# Altium project Keypadmacro.PrjPcb
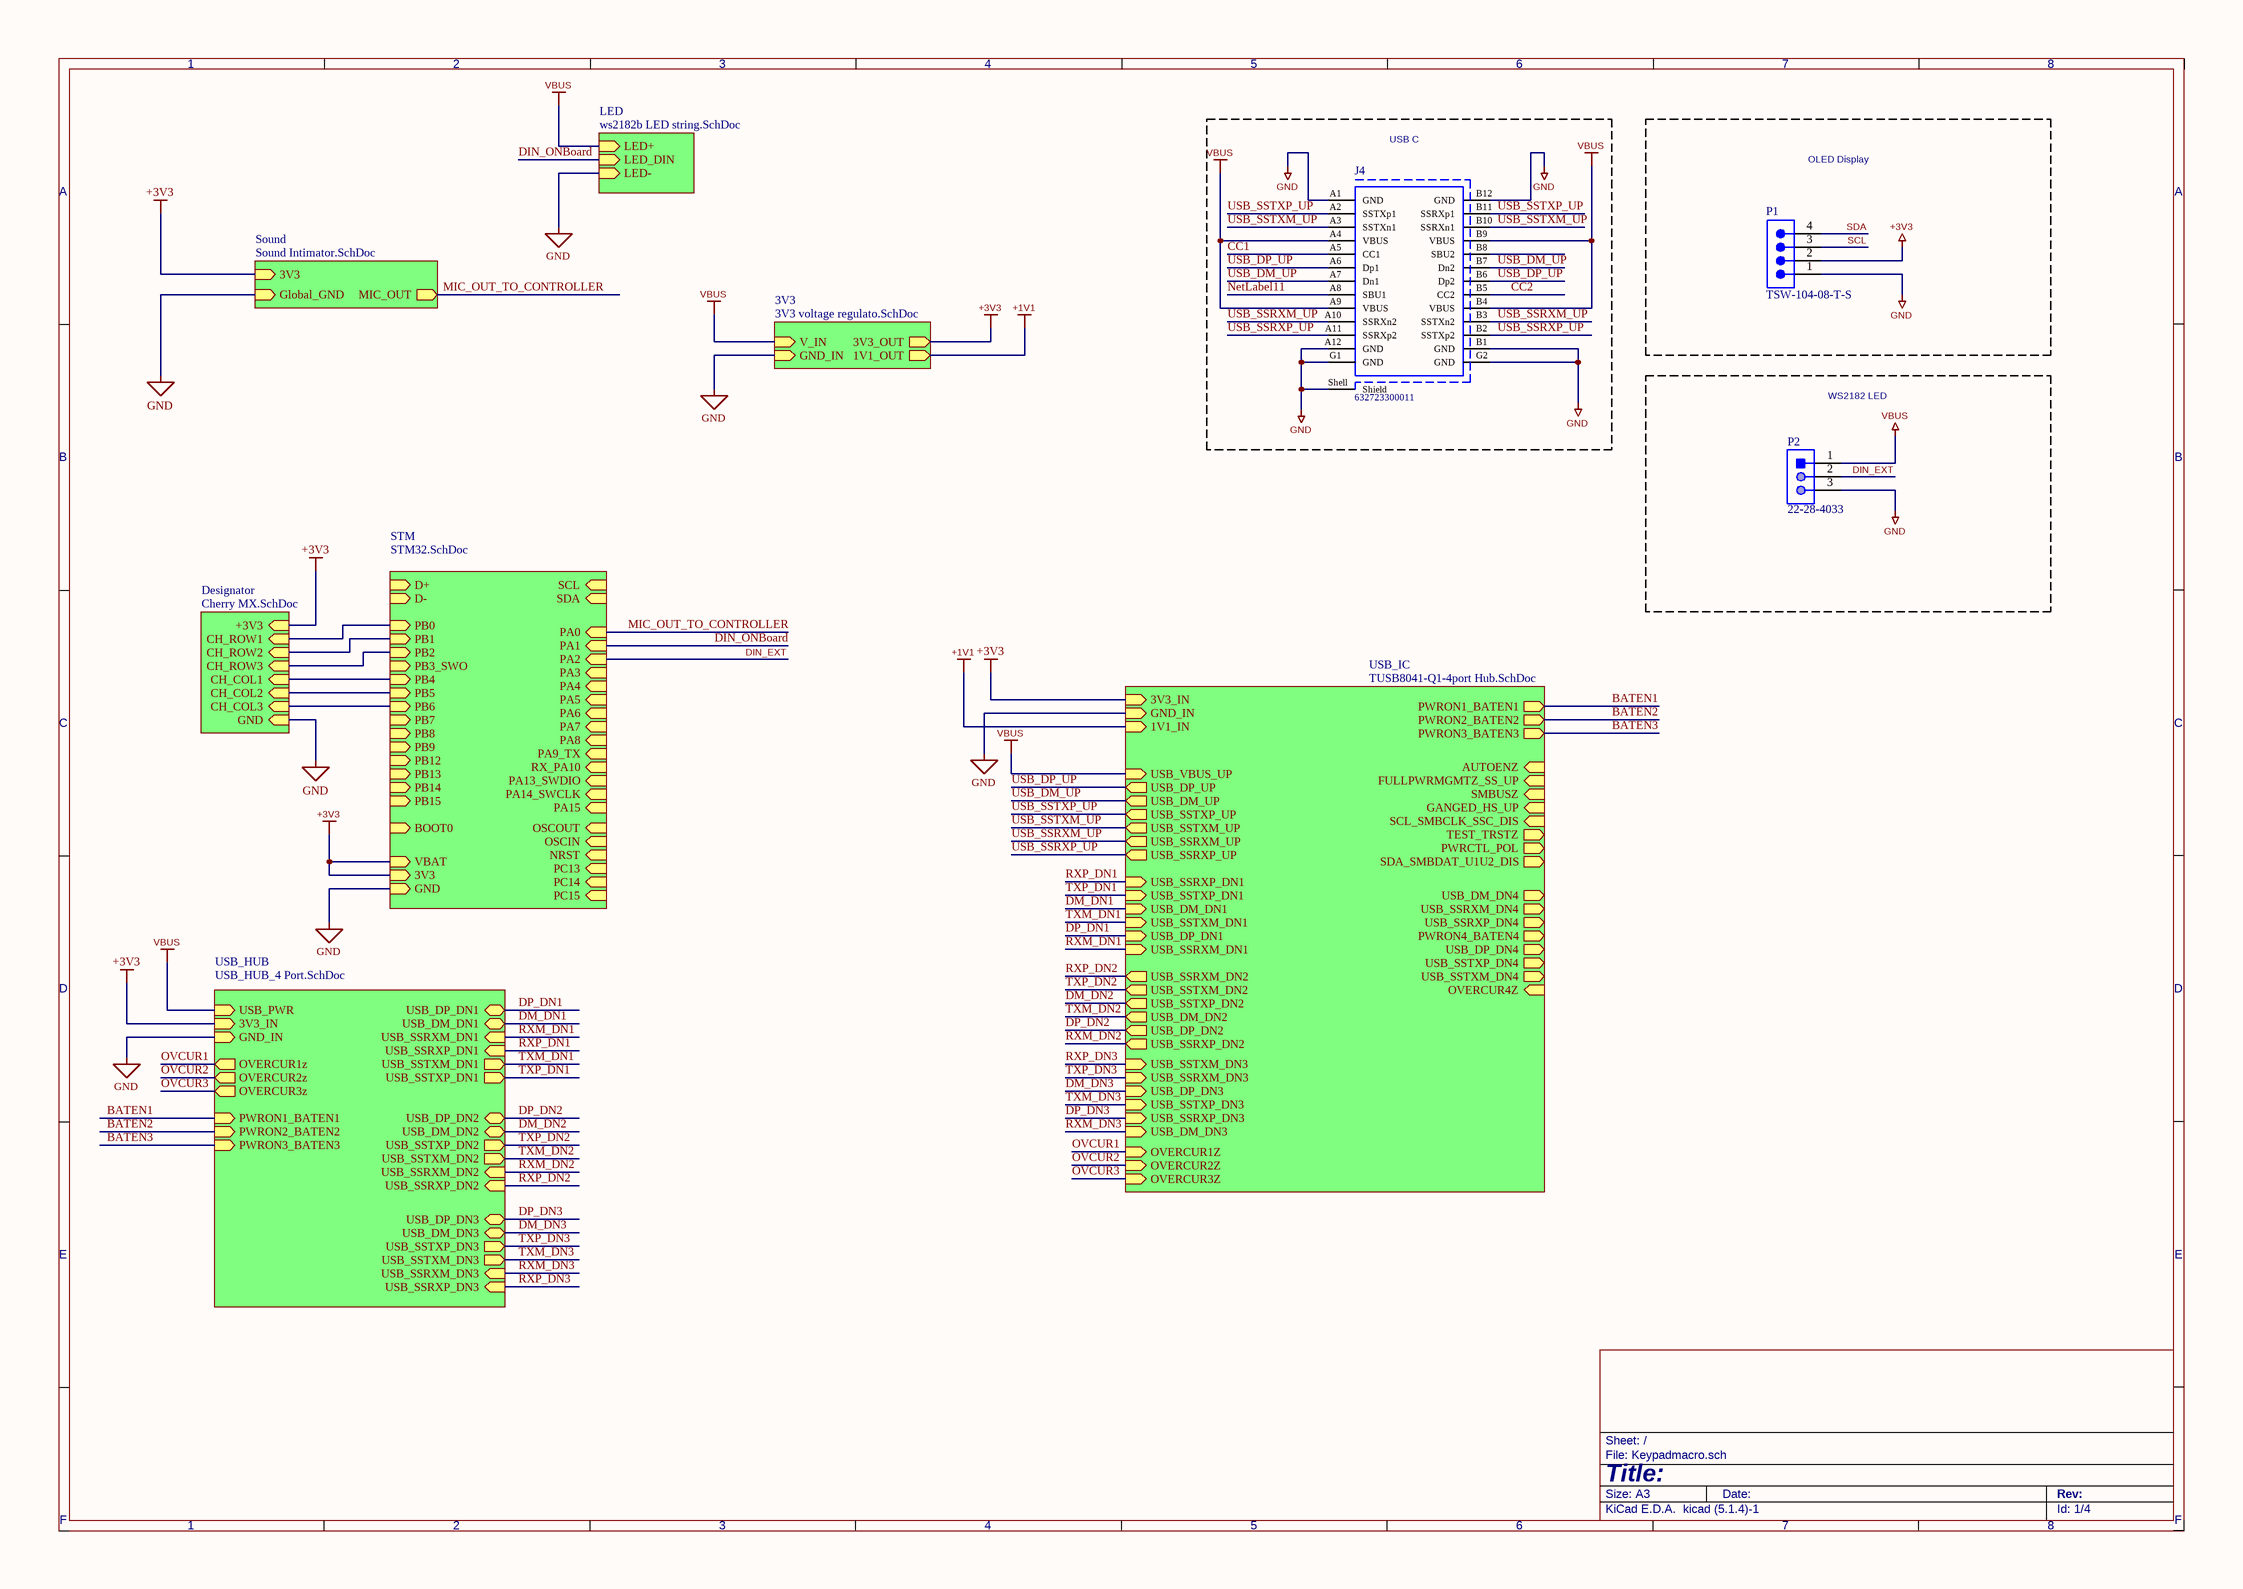
[diagram p0: Keypadmacro.SchDoc]
8 sheets, 114 parts. Net scope: hierarchical (ports join the sheet entries above them; power ports are global).
Board file: Keypadmacro.PcbDoc
Sheets:
  Keypadmacro.SchDoc
    Sound = Sound Intimator.SchDoc
    STM = STM32.SchDoc
    Designator = Cherry MX.SchDoc
    3V3 = 3V3 voltage regulato.SchDoc
    LED = ws2182b LED string.SchDoc
    USB_HUB = USB_HUB_4 Port.SchDoc
    USB_IC = TUSB8041-Q1-4port Hub.SchDoc

## Sheet Keypadmacro.SchDoc
size 419 x 297 mm

### Parts
J4  632723300011  [632723300011]
P1  TSW-104-08-T-S  [SMTC-TSW-104-08-X-S]
P2  22-28-4033  [MOLX-22-28-4033_V]

### Blocks framed on the sheet
USB C: J4
OLED Display: P1
WS2182 LED: P2

### Sub-sheets
3V3 = 3V3 voltage regulato.SchDoc: 3V3_OUT (out), GND_IN (in), V_IN (in), 1V1_OUT (out)
Designator = Cherry MX.SchDoc: CH_ROW2 (in), CH_COL3 (in), CH_ROW3 (in), GND (in), +3V3 (in), CH_COL2 (in), CH_ROW1 (in), CH_COL1 (in)
LED = ws2182b LED string.SchDoc: LED+ (in), LED_DIN (in), LED- (in)
Sound = Sound Intimator.SchDoc: 3V3 (in), Global_GND (in), MIC_OUT (out)
STM = STM32.SchDoc: 3V3 (in), VBAT (in), GND (in), D+ (in), D- (in), BOOT0 (in), NRST (in), PA0 (in), PA9_TX (in), PA6 (in), PA7 (in), PA1 (in), PA5 (in), PA3 (in), PA2 (in), PA4 (in), PA8 (in), PB13 (in), PB6 (in), PB9 (in), PB12 (in), PB14 (in), PB0 (in), PB4 (in), PB3_SWO (in), PB1 (in), PB8 (in), PB15 (in), PB5 (in), PB2 (in), PB7 (in), RX_PA10 (in), PC14 (in), PC15 (in), PA15 (in), PC13 (in), SCL (in), OSCIN (in), SDA (in), PA13_SWDIO (in), PA14_SWCLK (in), OSCOUT (in)
USB_HUB = USB_HUB_4 Port.SchDoc: USB_PWR (in), 3V3_IN (in), OVERCUR3z (out), OVERCUR1z (out), OVERCUR2z (out), PWRON2_BATEN2 (in), PWRON1_BATEN1 (in), PWRON3_BATEN3 (in), GND_IN (in), USB_DM_DN1 (bidir), USB_SSTXM_DN3 (out), USB_SSTXM_DN1 (out), USB_SSRXP_DN1 (in), USB_SSTXP_DN3 (out), USB_SSTXM_DN2 (out), USB_SSRXM_DN2 (in), USB_SSRXM_DN3 (in), USB_SSRXP_DN3 (in), USB_DM_DN2 (bidir), USB_DM_DN3 (bidir), USB_DP_DN1 (bidir), USB_SSTXP_DN1 (out), USB_DP_DN2 (bidir), USB_SSRXP_DN2 (in), USB_DP_DN3 (bidir), USB_SSTXP_DN2 (out), USB_SSRXM_DN1 (in)
USB_IC = TUSB8041-Q1-4port Hub.SchDoc: GND_IN (in), USB_SSRXP_DN3 (in), USB_DM_DN3 (in), USB_SSTXM_DN3 (in), 1V1_IN (in), PWRON4_BATEN4 (out), USB_SSRXP_DN4 (out), USB_SSTXP_DN3 (in), USB_DP_DN3 (in), 3V3_IN (in), USB_DM_DN4 (out), USB_DP_DN4 (out), USB_SSRXM_DN4 (out), USB_SSTXM_DN4 (out), USB_SSTXP_DN4 (out), USB_SSRXM_DN3 (in), USB_VBUS_UP (in), PWRON3_BATEN3 (out), PWRON2_BATEN2 (out), PWRON1_BATEN1 (out), SDA_SMBDAT_U1U2_DIS (out), USB_SSRXP_UP (out), USB_SSTXP_DN1 (in), USB_SSRXM_UP (out), USB_SSRXP_DN1 (in), USB_SSRXM_DN1 (in), USB_DP_DN1 (in), USB_SSTXP_UP (out), USB_DM_UP (out), OVERCUR2Z (in), OVERCUR1Z (in), TEST_TRSTZ (out), USB_DP_UP (out), USB_SSTXM_DN1 (in), USB_DM_DN1 (in), USB_SSTXM_UP (out), USB_DP_DN2 (out), USB_DM_DN2 (out), USB_SSTXP_DN2 (out), SCL_SMBCLK_SSC_DIS (in), USB_SSTXM_DN2 (out), USB_SSRXP_DN2 (out), USB_SSRXM_DN2 (out), AUTOENZ (in), OVERCUR3Z (in), GANGED_HS_UP (in), OVERCUR4Z (in), PWRCTL_POL (out), FULLPWRMGMTZ_SS_UP (in), SMBUSZ (in)

### Nets
+1V1: sheet 3V3/1V1_OUT, sheet USB_IC/1V1_IN
+3V3: P1.2 ; sheet Sound/3V3, sheet STM/3V3, sheet STM/VBAT, sheet Designator/+3V3, sheet 3V3/3V3_OUT, sheet USB_HUB/3V3_IN, sheet USB_IC/3V3_IN  [project net +3.3V]
GND: J4.A1(GND) J4.A12(GND) J4.B1(GND) J4.B12(GND) J4.G1(GND) J4.G2(GND) J4.Shell(Shield) P1.1 P2.3 ; sheet Sound/Global_GND, sheet STM/GND, sheet Designator/GND, sheet 3V3/GND_IN, sheet LED/LED-, sheet USB_HUB/GND_IN, sheet USB_IC/GND_IN
VBUS: J4.A4(VBUS) J4.A9(VBUS) J4.B4(VBUS) J4.B9(VBUS) P2.1 ; sheet 3V3/V_IN, sheet LED/LED+, sheet USB_HUB/USB_PWR, sheet USB_IC/USB_VBUS_UP  [project net +BATT]
BATEN1: sheet USB_HUB/PWRON1_BATEN1, sheet USB_IC/PWRON1_BATEN1
BATEN2: sheet USB_HUB/PWRON2_BATEN2, sheet USB_IC/PWRON2_BATEN2
BATEN3: sheet USB_HUB/PWRON3_BATEN3, sheet USB_IC/PWRON3_BATEN3
CC1: J4.A5(CC1)
CC2: J4.B5(CC2)
CH_COL1: sheet STM/PB4, sheet Designator/CH_COL1
CH_COL2: sheet STM/PB5, sheet Designator/CH_COL2
CH_COL3: sheet STM/PB6, sheet Designator/CH_COL3
CH_ROW1: sheet STM/PB0, sheet Designator/CH_ROW1
CH_ROW2: sheet STM/PB1, sheet Designator/CH_ROW2
CH_ROW3: sheet STM/PB2, sheet Designator/CH_ROW3
DIN_EXT: P2.2 ; sheet STM/PA2
DIN_ONBoard: sheet STM/PA1, sheet LED/LED_DIN  [project net D_IN]
DM_DN1: sheet USB_HUB/USB_DM_DN1, sheet USB_IC/USB_DM_DN1
DM_DN2: sheet USB_HUB/USB_DM_DN2, sheet USB_IC/USB_SSTXP_DN2
DM_DN3: sheet USB_HUB/USB_DM_DN3, sheet USB_IC/USB_DP_DN3
DP_DN1: sheet USB_HUB/USB_DP_DN1, sheet USB_IC/USB_DP_DN1
DP_DN2: sheet USB_HUB/USB_DP_DN2, sheet USB_IC/USB_DP_DN2
DP_DN3: sheet USB_HUB/USB_DP_DN3, sheet USB_IC/USB_SSRXP_DN3
MIC_OUT_TO_CONTROLLER: sheet Sound/MIC_OUT, sheet STM/PA0
NetLabel11: J4.A8(SBU1)
OVCUR1: sheet USB_HUB/OVERCUR1z, sheet USB_IC/OVERCUR1Z
OVCUR2: sheet USB_HUB/OVERCUR2z, sheet USB_IC/OVERCUR2Z
OVCUR3: sheet USB_HUB/OVERCUR3z, sheet USB_IC/OVERCUR3Z
RXM_DN1: sheet USB_HUB/USB_SSRXM_DN1, sheet USB_IC/USB_SSRXM_DN1
RXM_DN2: sheet USB_HUB/USB_SSRXM_DN2, sheet USB_IC/USB_SSRXP_DN2
RXM_DN3: sheet USB_HUB/USB_SSRXM_DN3, sheet USB_IC/USB_DM_DN3
RXP_DN1: sheet USB_HUB/USB_SSRXP_DN1, sheet USB_IC/USB_SSRXP_DN1
RXP_DN2: sheet USB_HUB/USB_SSRXP_DN2, sheet USB_IC/USB_SSRXM_DN2
RXP_DN3: sheet USB_HUB/USB_SSRXP_DN3, sheet USB_IC/USB_SSTXM_DN3
SCL: P1.3
SDA: P1.4
TXM_DN1: sheet USB_HUB/USB_SSTXM_DN1, sheet USB_IC/USB_SSTXM_DN1
TXM_DN2: sheet USB_HUB/USB_SSTXM_DN2, sheet USB_IC/USB_DM_DN2
TXM_DN3: sheet USB_HUB/USB_SSTXM_DN3, sheet USB_IC/USB_SSTXP_DN3
TXP_DN1: sheet USB_HUB/USB_SSTXP_DN1, sheet USB_IC/USB_SSTXP_DN1
TXP_DN2: sheet USB_HUB/USB_SSTXP_DN2, sheet USB_IC/USB_SSTXM_DN2
TXP_DN3: sheet USB_HUB/USB_SSTXP_DN3, sheet USB_IC/USB_SSRXM_DN3
USB_DM_UP: J4.A7(Dn1) J4.B7(Dn2) ; sheet USB_IC/USB_DM_UP
USB_DP_UP: J4.A6(Dp1) J4.B6(Dp2) ; sheet USB_IC/USB_DP_UP
USB_SSRXM_UP: J4.A10(SSRXn2) J4.B3(SSTXn2) ; sheet USB_IC/USB_SSRXM_UP
USB_SSRXP_UP: J4.A11(SSRXp2) J4.B2(SSTXp2) ; sheet USB_IC/USB_SSRXP_UP
USB_SSTXM_UP: J4.A3(SSTXn1) J4.B10(SSRXn1) ; sheet USB_IC/USB_SSTXM_UP
USB_SSTXP_UP: J4.A2(SSTXp1) J4.B11(SSRXp1) ; sheet USB_IC/USB_SSTXP_UP

Not connected (* = marked no-connect by the designer): J4 B8(SBU2)

### Notes on the sheet
- 1
- 2
- 3
- 4
- 5
- 6
- 7
- 8
- A
- B
- C
- D
- E
- Title:
- File: Keypadmacro.sch
- Sheet: /
- F
- KiCad E.D.A.  kicad (5.1.4)-1
- Size: A3
- Date:
- Rev:
- Id: 1/4

### Library data of the parts
J4 = CMP-1502-03214-1: USB 3.1 Type C Receptacle WR-COM, Horizontal, SMT / THT; Manufacturer: Wurth Elektronik; Rated Current: 5A; Contact Resistance: 30mOhm; Working Voltage: 20VDC; Operating Temperature: -40to105degC; Package Reference: 632723300011; Datasheet URL: https://katalog.we-online.de/em/datasheet/632723x00011%282%29.pdf; Manufacturer URL: http://www.we-online.de; Connector Type: USB3.1TypeC; Gender: Receptacle; Part Number: 632723300011; Mounting Technology: SMT/THT; Publisher: WurthElektronik; Packaging: TapeandReel; Orientation: Horizontal
P1 = CMP-1024-00356-1: 0.025" SQ Post Header, Through-hole, Vertical, -55 to 105 degC, 2.54 mm Pitch, 4-Pin, Male, RoHS; Manufacturer: Samtec; Pitch: 2.54 mm; PackageDescription: .025[0.64] SQ. Post Terminal Strip Assembly; ComponentLink2URL: http://www.samtec.com/documents/webfiles/pdf/TSW_TH.PDF; ComponentLink3URL: http://www.samtec.com/documents/webfiles/cpdf/TSW-XXX-XX-XXX-X-XX-XXX-MKT.pdf; PackageVersion: DM, 8/1988; ComponentLink3Description: Package Specification; DatasheetVersion: F-214; Orientation: Vertical; RoHS: True; Mounting Technology: Through-hole; ComponentLink1URL: http://www.samtec.com; PartNumber: TSW-104-08-T-S; ComponentLink1Description: Manufacturer URL; Temperature Range: -55 to 105 degC; ComponentLink2Description: Datasheet; PackageReference: TSW-104-08-X-S
P2 = CMP-1676-00001-5: Male Header, Pitch 2.54 mm, 1 x 3 Position, Height 8.38 mm, Tail Length 3.18 mm, RoHS, Bulk; Manufacturer: Molex; Rows: 1; Voltage Rating: 250 V; Current Rating: 4 A; Min Operating Temperature: 0 degC; Lead Pitch: 0.1 inch; Packaging: Bulk; Contact Finish: Gold; RoHSCompliant: true; Contact Material: Brass; PackageReference: 22-28-4033; REACH SVHC: Unknown; PackageDescription: Male Header, Pitch 2.54 mm, 1 x 3 Position, Height 8.38 mm, Tail Length 3.18 mm; ComponentLink2URL: http://www.molex.com/pdm_docs/sd/022284033_sd.pdf; Height: 8.38 mm; Mounting Technology: Through Hole; ComponentLink1Description: Manufacturer URL; Length: 7.62 mm; Mount: Through Hole; DatasheetVersion: Rev. G, 01/2012; Max Operating Temperature: 75 degC; ComponentLink2Description: Datasheet; Colour: Black; Pins: 3; Contact Plating: Gold; Package Quantity: 1; ComponentLink1URL: http://www.molex.com/

## Sheet Sound Intimator.SchDoc
size 297 x 210 mm
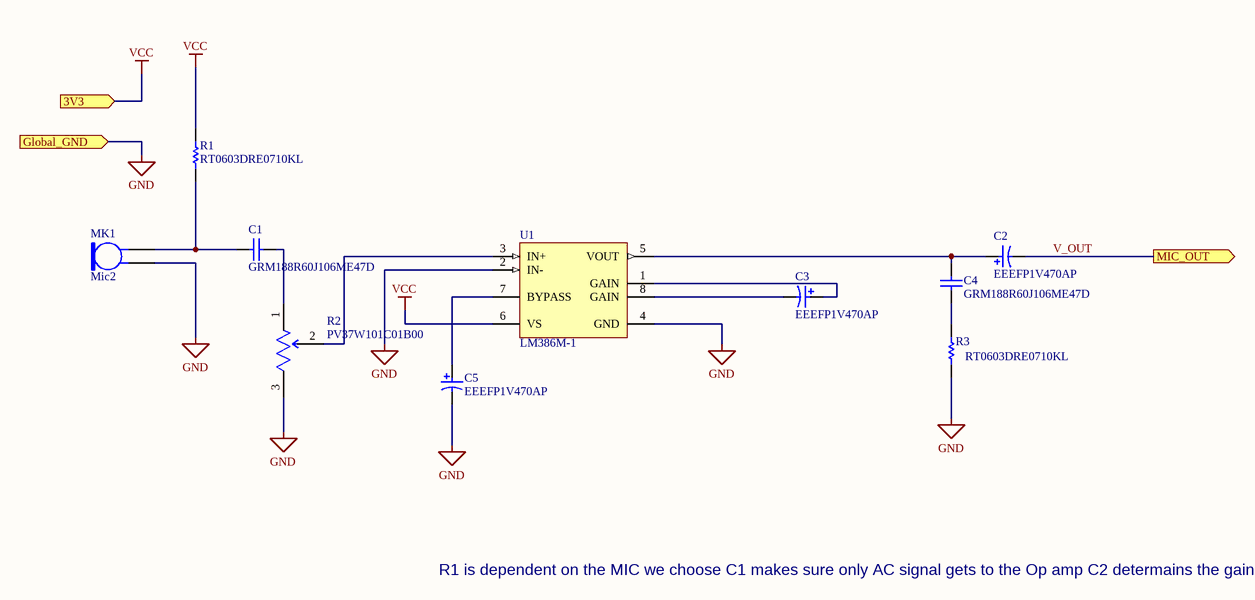
[diagram p1: Sound Intimator.SchDoc]

### Parts
C1  GRM188R60J106ME47D  [CAPC1608X90X35NL10T15]
C2  EEEFP1V470AP  [PNSC-FP-V-D_V]
C3  EEEFP1V470AP  [PNSC-FP-V-D_V]
C4  GRM188R60J106ME47D  [CAPC1608X90X35NL10T15]
C5  EEEFP1V470AP  [PNSC-FP-V-D_V]
MK1  Mic2  [PIN2]
R1  RT0603DRE0710KL  [RESC1608X55X25ML10T15]
R2  PV37W101C01B00  [FP-PV37W101C01B00-MFG]
R3  RT0603DRE0710KL  [RESC1608X55X25ML10T15]
U1  LM386M-1  [D0008A_M]

### Ports
3V3 (in), Global_GND (in), MIC_OUT (out)

### Nets
GND: C5.2 MK1.1 R2.3 R3.1 U1.2(IN-) U1.4(GND) ; port Global_GND
VCC: R1.2 U1.6(VS) ; port 3V3  [project net +3.3V]
V_OUT: C2.2 ; port MIC_OUT  [project net MIC_OUT_TO_CONTROLLER]
NetC1_1: C1.1 MK1.2 R1.1
NetC1_2: C1.2 R2.1
NetC2_1: C2.1 C4.2 U1.5(VOUT)
NetC3_1: C3.1 U1.1(GAIN)
NetC3_2: C3.2 U1.8(GAIN)
NetC4_1: C4.1 R3.2
NetC5_1: C5.1 U1.7(BYPASS)
NetR2_2: R2.2 U1.3(IN+)

### Notes on the sheet
- R1 is dependent on the MIC we choose
  C1 makes sure only AC signal gets to the Op amp
  C2 determains the gain of the OP Amp 20 to 200 gain
  C7 Is the Bypass Capacitor for stability of the op amp
  C3 removes the DC offset of the Output
- 1
- 2
- 3
- 4
- 5
- 6
- A
- B
- C
- D
- Title:
- File: Sound Intimator.sch
- Sheet: /
- KiCad E.D.A.  kicad (5.1.4)-1
- Size: A4
- Date:
- Rev:
- Id: 2/4

### Library data of the parts
C1 C4 = CMP-2006-02792-1: Manufacturer: Murata; Part Number: GRM188R60J106ME47D
C2 C3 C5 = CMP-2000-06216-1: Aluminum Electrolytic Capacitor, 47 uF, +/- 20%, 35 V, 2-Pin SMD (Size Code D), -55 to 105 degC, RoHS, Tape and Reel; Manufacturer: Panasonic; Lifetime@Temperature: 2000Hrs@105°C; Capacitance: 47µF; Type: Can; Rated Voltage: 35V; Ripple Current: 300mA; ESR (Equivalent Series Resistance): 0.26O; Package Reference: FP-V-D; Package Description: 2-Pin Electrolytic Aluminum Capacitor, Body 6.6 x 6.6 mm; Datasheet URL: http://industrial.panasonic.com/cdbs/www-data/pdf/RDE0000/ABA0000C1184.pdf; Series: FP; Operating Temp Range: -55to+105°C; Operating Temp-Max: 105°C; Datasheet Version: 03/2016; Manufacturer URL: http://www.panasonic.com/; Package URL: http://industrial.panasonic.com/cdbs/www-data/pdf/RDE0000/DME0000COL48.pdf; Case Size/Dimension: Ø6.3x5.8mm; Mounting Technology: SurfaceMount
MK1 = Mic2: Microphone; Published: 24-Mar-1999; LatestRevisionDate: 17-Jul-2002; LatestRevisionNote: Re-released for DXP Platform.; PackageReference: PIN2; Publisher: Altium Limited
R1 R3 = CMP-2000-04608-1: Manufacturer: Yageo; Part Number: RT0603DRE0710KL
R2 = CMP-06028-000002-1: TRIMMER 100 OHM 0.25W PC PIN TOP; Power Rating: 250mW; Number of Turns: 12; Temperature Coefficient: 150ppm/°C; Resistance: 100R; Tolerance: 10%; Max Operating Temperature: 125°C; Lead Free: Lead Free; Mount: Through Hole; Width: 0.157inch; Composition: Cermet; Package Quantity: 50; Color: Grey; Weight: 340mg; Max Power Dissipation: 250mW; Radiation Hardening: No; Min Operating Temperature: -55°C; Height: 0.264inch; Packaging: Bulk; Length: 0.252inch; Termination: PC Pin; Taper: Linear
U1 = CMP-0057-00421-3: Low Voltage Audio Power Amplifier, 8-pin Narrow SOIC; Manufacturer: Texas Instruments; PackageTopMarking: NSZXTT*LM386*M-1; CompType: Audio IC; PowerWise: N; ComponentLink1Description: Datasheet URL; Code_IPC: SOIC127P600-8; PackageDescription: SOIC Narrow, 4.9 x 3.9 x 1.45mm, 8 Lead, 1.27mm Pitch; Code_JEDEC: MS-012-AA; PinCount: 8; ComponentLink1URL: http://www.ti.com/general/docs/lit/getliterature.tsp?genericPartNumber=LM386&fileType=pdf; RoHS: N; PackageReference: D0008A

## Sheet STM32.SchDoc
size 297 x 210 mm
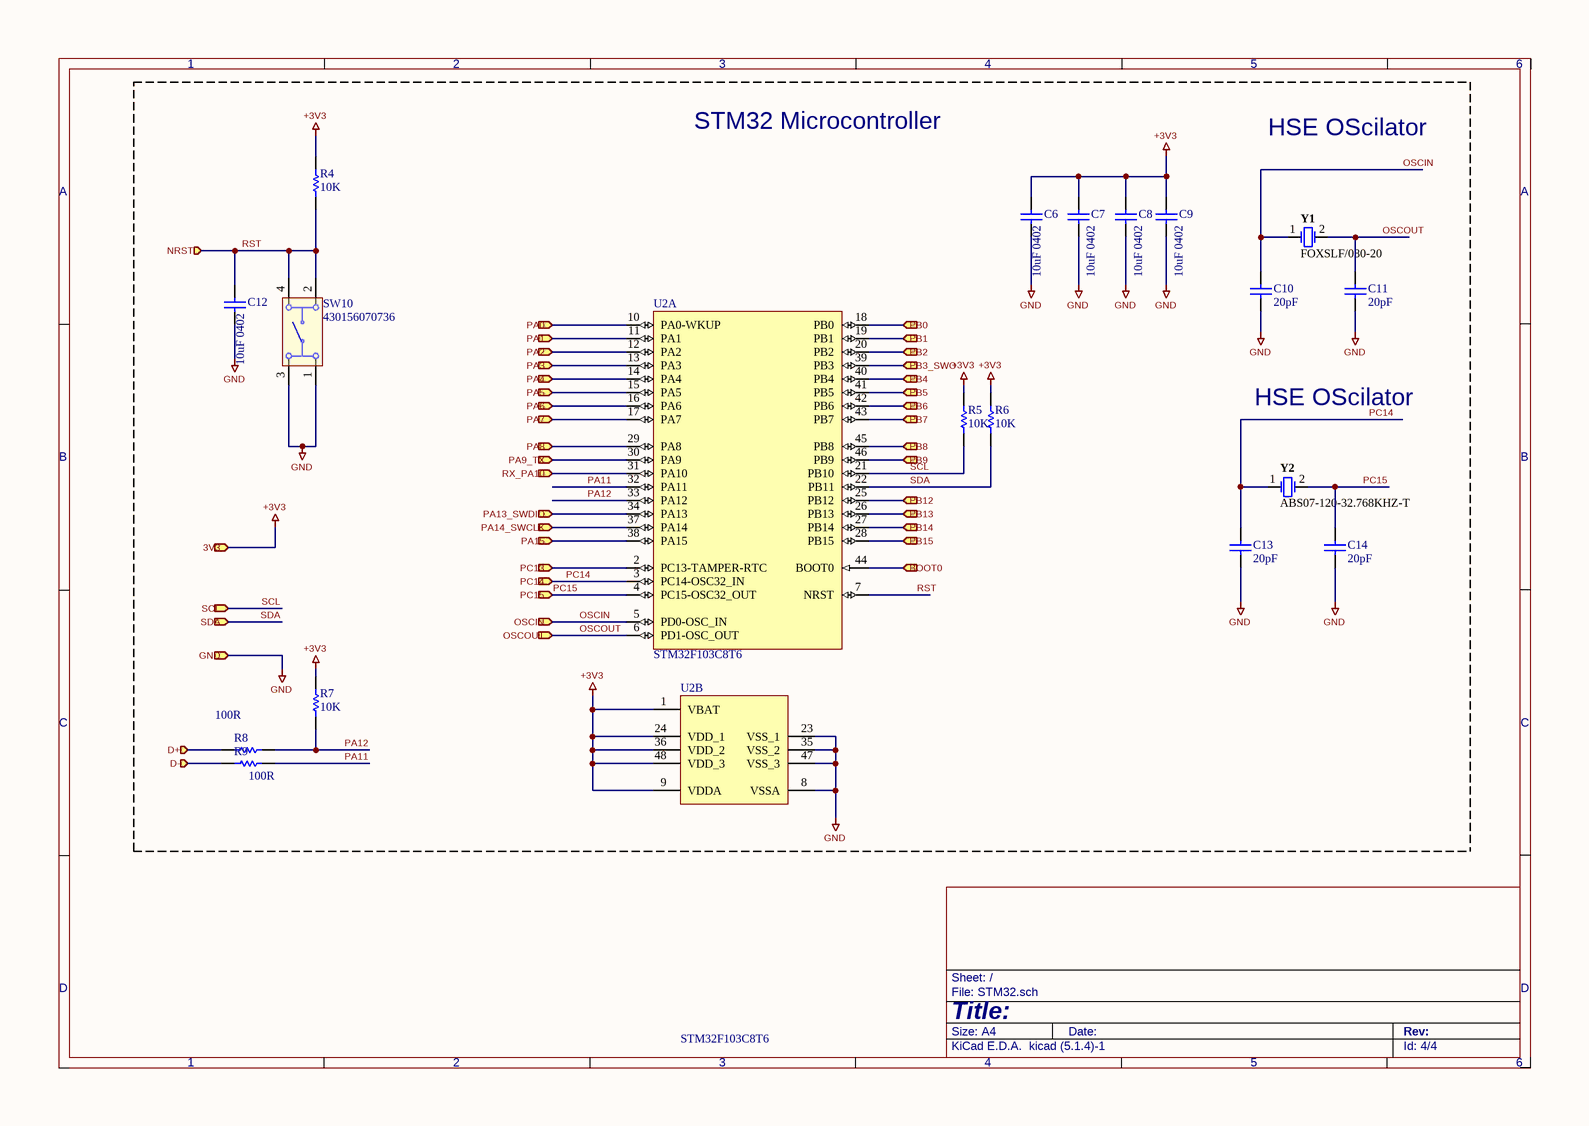
[diagram p2: STM32.SchDoc]

### Parts
C6  10uF 0402  [CAPC1005X55X30ML05T10]
C7  10uF 0402  [CAPC1005X55X30ML05T10]
C8  10uF 0402  [CAPC1005X55X30ML05T10]
C9  10uF 0402  [CAPC1005X55X30ML05T10]
C10  20pF  [CAPC1005X56X25NL10T15]
C11  20pF  [CAPC1005X56X25NL10T15]
C12  10uF 0402  [CAPC1005X55X30ML05T10]
C13  20pF  [CAPC1005X56X25NL10T15]
C14  20pF  [CAPC1005X56X25NL10T15]
R4  10K  [RESC1005X40X25NL05T05]
R5  10K  [RESC1005X40X25NL05T05]
R6  10K  [RESC1005X40X25NL05T05]
R7  10K  [RESC1005X40X25NL05T05]
R8  100R  [RESC1005X40X25NL05T05]
R9  100R  [RESC1005X40X25NL05T05]
SW10  430156070736  [430156070736]
U2  STM32F103C8T6  [STM-LQFP48_L]  (parts A,B of 2)
Y1  FOXSLF/080-20  [FOX-FOXSLF080-20]
Y2  ABS07-120-32.768KHZ-T  [ABRA-ABS07_A_V]

### Ports
3V3 (in), BOOT0 (in), D+ (in), D- (in), GND (in), NRST (in), OSCIN (in), OSCOUT (in), PA0 (in), PA1 (in), PA2 (in), PA3 (in), PA4 (in), PA5 (in), PA6 (in), PA7 (in), PA8 (in), PA9_TX (in), PA13_SWDIO (in), PA14_SWCLK (in), PA15 (in), PB0 (in), PB1 (in), PB2 (in), PB3_SWO (in), PB4 (in), PB5 (in), PB6 (in), PB7 (in), PB8 (in), PB9 (in), PB12 (in), PB13 (in), PB14 (in), PB15 (in), PC13 (in), PC14 (in), PC15 (in), RX_PA10 (in), SCL (in), SDA (in)

### Nets
+3V3: C6.2 C7.2 C8.2 C9.2 R4.2 R5.2 R6.2 R7.2 U2.1(VBAT) U2.9(VDDA) U2.24(VDD_1) U2.36(VDD_2) U2.48(VDD_3) ; port 3V3  [project net +3.3V]
GND: C6.1 C7.1 C8.1 C9.1 C10.1 C11.1 C12.1 C13.1 C14.1 SW10.1 SW10.3 U2.8(VSSA) U2.23(VSS_1) U2.35(VSS_2) U2.47(VSS_3) ; port GND
BOOT0: U2.44(BOOT0) ; port BOOT0
CH_COL1: U2.40(PB4) ; port PB4
CH_COL2: U2.41(PB5) ; port PB5
CH_COL3: U2.42(PB6) ; port PB6
CH_ROW1: U2.18(PB0) ; port PB0
CH_ROW2: U2.19(PB1) ; port PB1
CH_ROW3: U2.20(PB2) ; port PB2
D+: R8.2 ; port D+
D-: R9.2 ; port D-
D_IN: U2.11(PA1) ; port PA1
DIN_EXT: U2.12(PA2) ; port PA2
MIC_OUT_TO_CONTROLLER: U2.10(PA0-WKUP) ; port PA0
OSCIN: C10.2 U2.5(PD0-OSC_IN) Y1.1 ; port OSCIN
OSCOUT: C11.2 U2.6(PD1-OSC_OUT) Y1.2 ; port OSCOUT
PA3: U2.13(PA3) ; port PA3
PA4: U2.14(PA4) ; port PA4
PA5: U2.15(PA5) ; port PA5
PA6: U2.16(PA6) ; port PA6
PA7: U2.17(PA7) ; port PA7
PA8: U2.29(PA8) ; port PA8
PA9_TX: U2.30(PA9) ; port PA9_TX
PA11: R9.1 U2.32(PA11)
PA12: R7.1 R8.1 U2.33(PA12)
PA13_SWDIO: U2.34(PA13) ; port PA13_SWDIO
PA14_SWCLK: U2.37(PA14) ; port PA14_SWCLK
PA15: U2.38(PA15) ; port PA15
PB3_SWO: U2.39(PB3) ; port PB3_SWO
PB7: U2.43(PB7) ; port PB7
PB8: U2.45(PB8) ; port PB8
PB9: U2.46(PB9) ; port PB9
PB12: U2.25(PB12) ; port PB12
PB13: U2.26(PB13) ; port PB13
PB14: U2.27(PB14) ; port PB14
PB15: U2.28(PB15) ; port PB15
PC13: U2.2(PC13-TAMPER-RTC) ; port PC13
PC14: C13.2 U2.3(PC14-OSC32_IN) Y2.1 ; port PC14
PC15: C14.2 U2.4(PC15-OSC32_OUT) Y2.2 ; port PC15
RST: C12.2 R4.1 SW10.2 SW10.4 U2.7(NRST) ; port NRST
RX_PA10: U2.31(PA10) ; port RX_PA10
SCL: R5.1 U2.21(PB10) ; port SCL
SDA: R6.1 U2.22(PB11) ; port SDA

### Notes on the sheet
- STM32 Microcontroller
- HSE OScilator
- 1
- 2
- 3
- 4
- 5
- 6
- A
- B
- C
- D
- Title:
- File: STM32.sch
- Sheet: /
- KiCad E.D.A.  kicad (5.1.4)-1
- Size: A4
- Date:
- Rev:
- Id: 4/4

### Library data of the parts
C6-C9 C12 = CMP-2008-03080-1: Manufacturer: Kemet; Part Number: C0402C104J4RACTU
C10 C11 C13 C14 = CMP-2008-02607-1: Part Number: 04025A200JAT2A; Manufacturer: AVX Interconnect / Elco
R4-R9 = CMP-2002-08523-1: Manufacturer: Vishay Dale; Part Number: CRCW0402330RFKED
SW10 = CMP-1453-00006-1: WS-TATV THT Tact Switch 6X6 mm; Manufacturer: Wuerth Elektronik; NoPins: 04; ComponentLink2URL: http://katalog.we-online.de/em/datasheet/4301x6.pdf; ComponentLink1Description: Manufacturer URL; PackageReference: 430156070736; ComponentLink2Description: Datasheet; PartNumber: 430156070736; ComponentLink1URL: http://www.we-online.com
U2 = CMP-0237-00215-3: ARM Cortex-M3 32-bit MCU, 64 KB Flash, 20 KB Internal RAM, 37 I/Os, 48-pin LQFP, -40 to 85 degC, Tray; Supply Voltage(Vcc) min (V): 2; Internal RAM Size (kB): 20; FLASH Size (Prog) (kB): 64; A/D Converter: 2x12-bit (10 Channel); I/Os (High Current): 37; Operating Frequency(F) (Processor speed) (MHz): 72; Core: ARM Cortex-M3; ComponentLink3Description: Package Specification; Mounting Technology: Surface Mount; PartNumber: STM32F103C8T6; PackageReference: LQFP48; Packing: Tray; ComponentLink3URL: http://www.st.com/st-web-ui/static/active/en/resource/technical/document/datasheet/DM00058181.pdf; DatasheetVersion: Rev. 16; ComponentLink1URL: http://www.st.com/web/en/home.html; PackageVersion: Rev. 6, 06/2013; ComponentLink2URL: http://www.st.com/st-web-ui/static/active/en/resource/technical/document/datasheet/CD00161566.pdf; ComponentLink1Description: Manufacturer URL; ComponentLink2Description: Datasheet; PackageDescription: 48-Pin Low Profile Quad Flat Package, 7 x 7 mm Body, 0.5 mm Pitch
Y1 = CMP-1749-00002-1: Resistance Weld Thru-Hole Crystal, 8 MHz, -20 to 70 degC, 2-Pin THD, RoHS, Bulk; Dropout Voltage: 2 V; Outputs: 1; Nominal Output Voltage: 5 V; Min Input Voltage: 7 V; Case\Package: TO-263-3; Max Input Voltage: 35 V; Max Ouput Current: 1 A; Length: 10.24 mm; Max Operating Temperature: 125 degC; Mount: Surface Mount; PackageDescription: 2-Pin Through Hole Device, Body 11.35 x 4.65 mm; Package Quantity: 50; Pins: 3; ComponentLink2URL: http://download.siliconexpert.com/pdfs/2015/4/5/6/5/7/200/fox_/manual/35607121449963728hc49slf.pdf; PackageReference: FOXSLF080-20; Min Operating Temperature: 0 degC; Height: 30.02 mm; Packaging: Rail/Tube; Radiation Hardening: No; Width: 9.35 mm; ComponentLink1URL: http://www.foxonline.com/; DatasheetVersion: Mar-15; ComponentLink1Description: Manufacturer URL; Output Voltage: 5 V; RoHSCompliant: true; REACH SVHC: No SVHC; Output Current: 1 A; ComponentLink2Description: Datasheet
Y2 = CMP-2000-07587-1: Tuning Fork Crystal, 32.768 KHz, +/- 20 ppm, -40 to 85 degC, 2-Pin SMD, RoHS, Tape and Reel; Manufacturer: Abracon; Case\/Package: SMD/SMT; Series Resistance: 60KOhm; Frequency Tolerance: 20ppm; Load Capacitance: 6pF; ESR (Equivalent Series Resistance): 55KOhm; Max Operating Temperature: 85degC; Width: 0.061inch; Radiation Hardening: No; Lead Free: LeadFree; RoHSCompliant: True; Depth: 1.5mm; Datasheet URL: http://www.abracon.com/Resonators/ABS07-120-32.768kHz-T.pdf; Frequency: 32.768KHz; Termination: SMD/SMT; Manufacturer URL: http://www.abracon.com/; Package Quantity: 3000; Packaging: TapeandReel; Number of Pins: 2; Height: 0.035inch; Package Description: 2-Pin Surface Mount Device, Body 3.2 x 1.5 mm; Package Reference: ABS07; Mount: SurfaceMount; Tolerance: 20ppm; Mounting Technology: SurfaceMount; REACH SVHC: NoSVHC; Datasheet Version: 11/2014; Length: 3.2mm; Min Operating Temperature: -40degC

## Sheet Cherry MX.SchDoc
size 297 x 210 mm
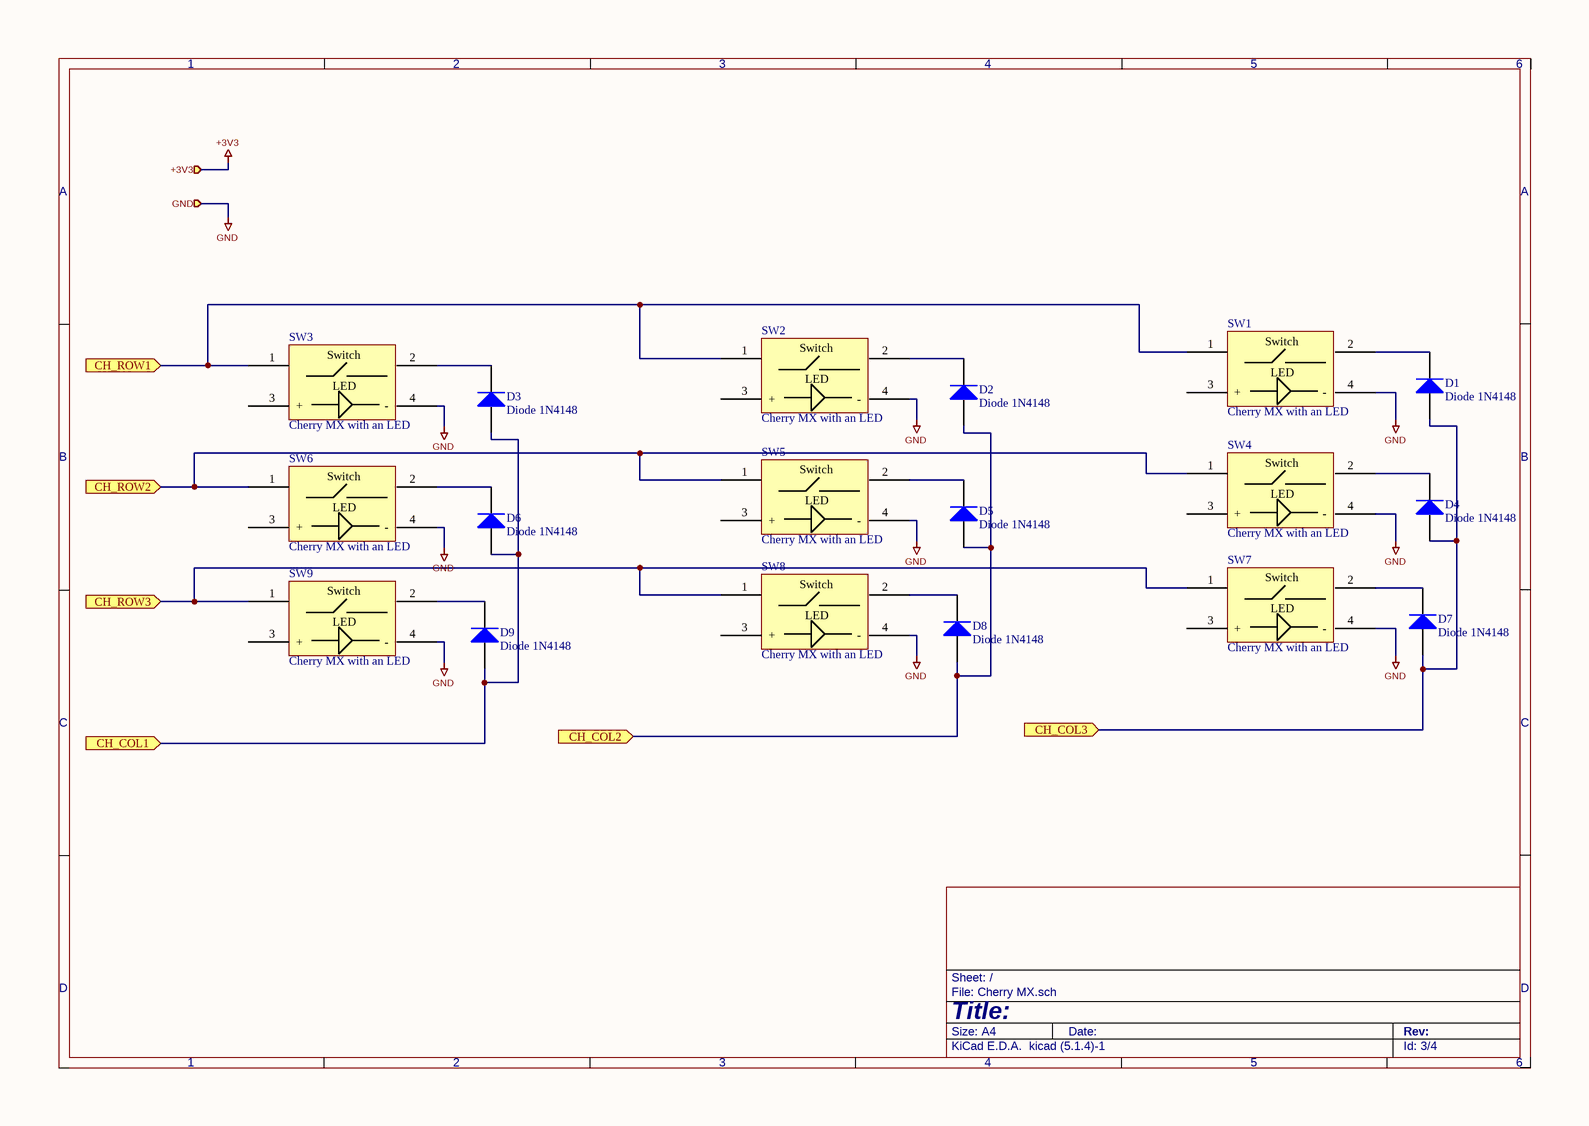
[diagram p3: Cherry MX.SchDoc]

### Parts
D1  Diode 1N4148  [DO-35]
D2  Diode 1N4148  [DO-35]
D3  Diode 1N4148  [DO-35]
D4  Diode 1N4148  [DO-35]
D5  Diode 1N4148  [DO-35]
D6  Diode 1N4148  [DO-35]
D7  Diode 1N4148  [DO-35]
D8  Diode 1N4148  [DO-35]
D9  Diode 1N4148  [DO-35]
SW1  Cherry MX with an LED  [MX_Cherry_LED]
SW2  Cherry MX with an LED  [MX_Cherry_LED]
SW3  Cherry MX with an LED  [MX_Cherry_LED]
SW4  Cherry MX with an LED  [MX_Cherry_LED]
SW5  Cherry MX with an LED  [MX_Cherry_LED]
SW6  Cherry MX with an LED  [MX_Cherry_LED]
SW7  Cherry MX with an LED  [MX_Cherry_LED]
SW8  Cherry MX with an LED  [MX_Cherry_LED]
SW9  Cherry MX with an LED  [MX_Cherry_LED]

### Ports
+3V3 (in), CH_COL1 (in), CH_COL2 (in), CH_COL3 (in), CH_ROW1 (in), CH_ROW2 (in), CH_ROW3 (in), GND (in)

### Nets
GND: SW1.4(-) SW2.4(-) SW3.4(-) SW4.4(-) SW5.4(-) SW6.4(-) SW7.4(-) SW8.4(-) SW9.4(-) ; port GND
CH_COL1: D3.1(A) D6.1(A) D9.1(A) ; port CH_COL1
CH_COL2: D2.1(A) D5.1(A) D8.1(A) ; port CH_COL2
CH_COL3: D1.1(A) D4.1(A) D7.1(A) ; port CH_COL3
CH_ROW1: SW1.1 SW2.1 SW3.1 ; port CH_ROW1
CH_ROW2: SW4.1 SW5.1 SW6.1 ; port CH_ROW2
CH_ROW3: SW7.1 SW8.1 SW9.1 ; port CH_ROW3
NetD1_2: D1.2(K) SW1.2
NetD2_2: D2.2(K) SW2.2
NetD3_2: D3.2(K) SW3.2
NetD4_2: D4.2(K) SW4.2
NetD5_2: D5.2(K) SW5.2
NetD6_2: D6.2(K) SW6.2
NetD7_2: D7.2(K) SW7.2
NetD8_2: D8.2(K) SW8.2
NetD9_2: D9.2(K) SW9.2

Not connected (* = marked no-connect by the designer): SW1 3(+); SW2 3(+); SW3 3(+); SW4 3(+); SW5 3(+); SW6 3(+); SW7 3(+); SW8 3(+); SW9 3(+)

### Notes on the sheet
- 1
- 2
- 3
- 4
- 5
- 6
- A
- B
- C
- D
- Title:
- File: Cherry MX.sch
- Sheet: /
- KiCad E.D.A.  kicad (5.1.4)-1
- Size: A4
- Date:
- Rev:
- Id: 3/4
- (in symbol MX_Cherry_LED) Switch; LED

### Library data of the parts
D1-D9 = Diode 1N4148: High Conductance Fast Diode; Published: 8-Jun-2000; LatestRevisionDate: 17-Jul-2002; LatestRevisionNote: Re-released for DXP Platform.; DatasheetVersion: 1997; PackageReference: DO-35; Publisher: Altium Limited; PackageDescription: Diode, Axial; Body 3.8 x 1.9 mm (LxDia. max), Lead Dia. 0.53 mm (max); Code_JEDEC: DO-204-AH; ComponentLink1Description: Manufacturer Link; ComponentLink1URL: http://www.fairchildsemi.com/; ComponentLink2Description: Datasheet; ComponentLink2URL: http://www.fairchildsemi.com/ds/1N%2F1N4148.pdf
SW1-SW9 = MX_Cherry_LED

## Sheet 3V3 voltage regulato.SchDoc
size A4
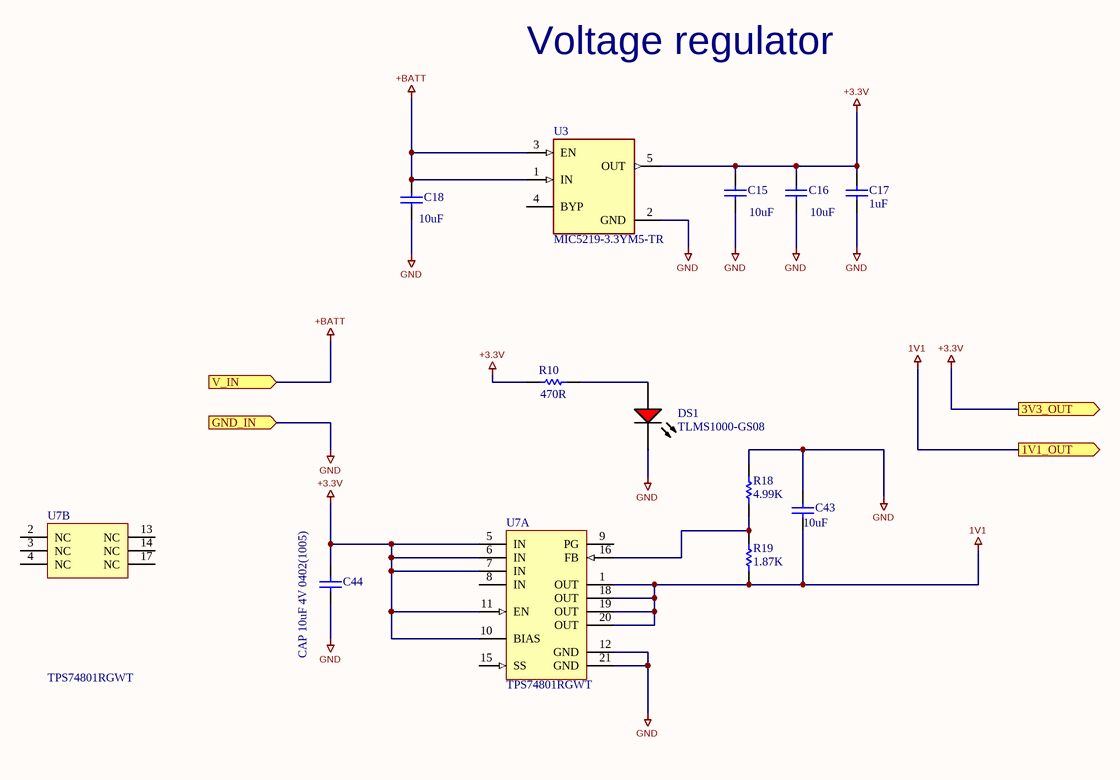
[diagram p4: 3V3 voltage regulato.SchDoc]

### Parts
C15  10uF  [CAPC1608X90X35NL10T15]
C16  10uF  [CAPC1608X90X35NL10T15]
C17  1uF  [CAPC1608X90X35LL10T15]
C18  10uF  [CAPC1608X90X35NL10T15]
C43  10uF  [CAPC0402(1005)60_L]
C44  CAP 10uF 4V 0402(1005)  [CAPC0402(1005)60_L]
DS1  TLMS1000-GS08  [VISH-TLMS1000_V]
R10  470R  [RESC1608X55X25LL10T15]
R18  4.99K  [RESC0402(1005)_N]
R19  1.87K  [RESC0402(1005)_N]
U3  MIC5219-3.3YM5-TR  [FP-SOT23-5LD-PL-1-IPC_C]
U7  TPS74801RGWT  [RGW0020A_V]  (parts A,B of 2)

### Ports
1V1_OUT (out), 3V3_OUT (out), GND_IN (in), V_IN (in)

### Nets
1V1: C43.1 R19.1 U7.1(OUT) U7.18(OUT) U7.19(OUT) U7.20(OUT) ; port 1V1_OUT  [project net +1V1]
+3.3V: C15.2 C16.2 C17.2 C44.2 R10.1 U3.5(OUT) U7.5(IN) U7.6(IN) U7.7(IN) U7.10(BIAS) U7.11(EN) ; port 3V3_OUT
+BATT: C18.2 U3.1(IN) U3.3(EN) ; port V_IN
GND: C15.1 C16.1 C17.1 C18.1 C43.2 C44.1 DS1.2(K) R18.2 U3.2(GND) U7.12(GND) U7.21(GND) ; port GND_IN
NetDS1_1: DS1.1(A) R10.2
NetR18_1: R18.1 R19.2 U7.16(FB)

Not connected (* = marked no-connect by the designer): U3 4(BYP); U7 2(NC) 3(NC) 4(NC) 8(IN) 9(PG) 13(NC) 14(NC) 15(SS) 17(NC)

### Notes on the sheet
- Voltage regulator

### Library data of the parts
C15 C16 C18 = CMP-2006-02792-1: Part Number: GRM188R60J106ME47D; Manufacturer: Murata
C17 = CMP-2006-02459-1: Manufacturer: Murata; Part Number: GRM188R61E105KA12D
C43 C44 = CMP-1034-02139-1: CAP 10uF 4V ±20% 0402 (1005 Metric) Thickness 0.6mm SMD; Tolerance: Â±20%; Case-EIA: 0402; Case-Metric: 1005; Value: 10uF; Technology: SMT; Max Thickness: 0.6 mm; Rated Voltage: 4 V
DS1 = CMP-2000-07254-1: Low Current LED, 40 mW, 1.8 V, -40 to 100 degC, 2-Pin SMD (0603), RoHS, Tape and Reel; Manufacturer: Vishay; Lens Shape: Rectangular; Automotive Qualification Standard: AEC-Q100; Wavelength Typ: 636nm; SVHC: ToBeAdvised; LED Colour: Red; Bulb Size: 1.6mmx0.8mm; Forward Voltage: 1.8V; Luminous Intensity: 4mcd; Forward Current If: 2mA; Viewing Angle: 80°; Datasheet Version: Rev. 1.7, 02/2011; Datasheet URL: https://datasheet.ciiva.com/5798/1698881-5798337.pdf; LED Mounting: SMD; Packaging: CutTape; Package Reference: TLMS1000; Manufacturer URL: http://www.vishay.com/; Mounting Technology: SurfaceMount; Product Range: -; Package Description: 2-Pin Surface Mount Device, Body 1.6 x 0.8 mm; MSL: MSL2-1year
R10 = CMP-1659-00035-1: General Purpose Chip Resistor, 470 Ohm, +/- 1%, -55 to 155 degC, 0603 (1608 Metric), RoHS, Tape and Reel; Impedance: 50 Ohm; Fastening Type: Snap; Min Operating Temperature: -40 degC; Length: 3 mm; PackageReference: 0603; Contact Material: Brass; Max Operating Temperature: 90 degC; ComponentLink2URL: https://datasheet.ciiva.com/11808/0900766b80f96399-11808177.pdf; Packaging: Tape and Reel; DatasheetVersion: Rev. 4, 04/2009; Contact Plating: Gold; Radiation Hardening: No; Height: 1.25 mm; Resistance: 50 Ohm; RoHSCompliant: true; ComponentLink2Description: Datasheet; Package Quantity: 2500; ComponentLink1URL: http://www.yageo.com/; Width: 3.1 mm; Mount: Surface Mount; PackageDescription: 2-Pin Surface Mount Device, Body 1.6 x 0.8 mm; ComponentLink1Description: Manufacturer URL
R18 R19 = CMP-1011-00001-1: Jumper 0402 (1005 Metric); Tolerance: None; Case-Metric: 1005; Case-EIA: 0402; Value: 0.00 Ohm; Power: None; Technology: SMT
U3 = CMP-06324-000027-1: IC REG LINEAR 3.3V 500MA SOT23-5; Dropout Voltage: 350mV; Output Type: Fixed; Number of Regulators: 1; Max Input Voltage: 12V; Min Input Voltage: 2.5V; Min Operating Temperature: -40°C; Nominal Output Voltage: 3.3V; Output Voltage: 3.3V; Packaging: Cut Tape; Mount: Surface Mount; Number of Pins: 5; Case/Package: SOT-23-5; Lead Free: Lead Free; Max Operating Temperature: 125°C; REACH SVHC: No SVHC; Output Current: 500mA
U7 = CMP-0395-01394-2: Single Output LDO, 1.5 A, Adjustable 0.8 to 3.6 V Output, 0.8 to 5.5 V Input, with Programmable Soft Start, 20-pin VQFN (RGW), -40 to 125 degC, Green (RoHS & no Sb/Br); Manufacturer: Texas Instruments; Vout Adj(Min)(V): 0.8; Vout Adj(Max)(V): 3.6; Iout(Max)(A): 1.5; Iq(Typ)(mA): 1; Power Good: TRUE; Accuracy(%): 2; Vdo(Typ)(mV): 60; Vin(Max)(V): 5.5; SubFamily: Single Channel LDO; Rating: Catalog; ComponentLink2Description: Datasheet; ComponentLink1URL: http://www.ti.com/; PackageDescription: 20-Pin Plastic Quad Flat No-Pin, 5 x 5 mm Body, 0.65 mm Pitch, 3.15 x 3.15 mm Exposed Pad; ComponentLink3Description: Package Specification; Code_JEDEC: MO-220; Vin(Min)(V): 0.8; PartNumber: TPS74801RGWT; ComponentLink4URL: Samples URL:http://www.ti.com/product/tps74801#samples; ComponentLink1Description: Manufacturer URL; PackageReference: RGW0020A; ComponentLink2URL: http://www.ti.com/general/docs/lit/getliterature.tsp?genericPartNumber=TPS74801&fileType=pdf; Mounting Technology: Surface Mount; ComponentLink4Description: URL Link1; DatasheetVersion: SBVS074J; ComponentLink3URL: http://www.ti.com/litv/pdf/mpqf122b; Eco-Plan: Green (RoHS & no Sb/Br)

## Sheet ws2182b LED string.SchDoc
size A4
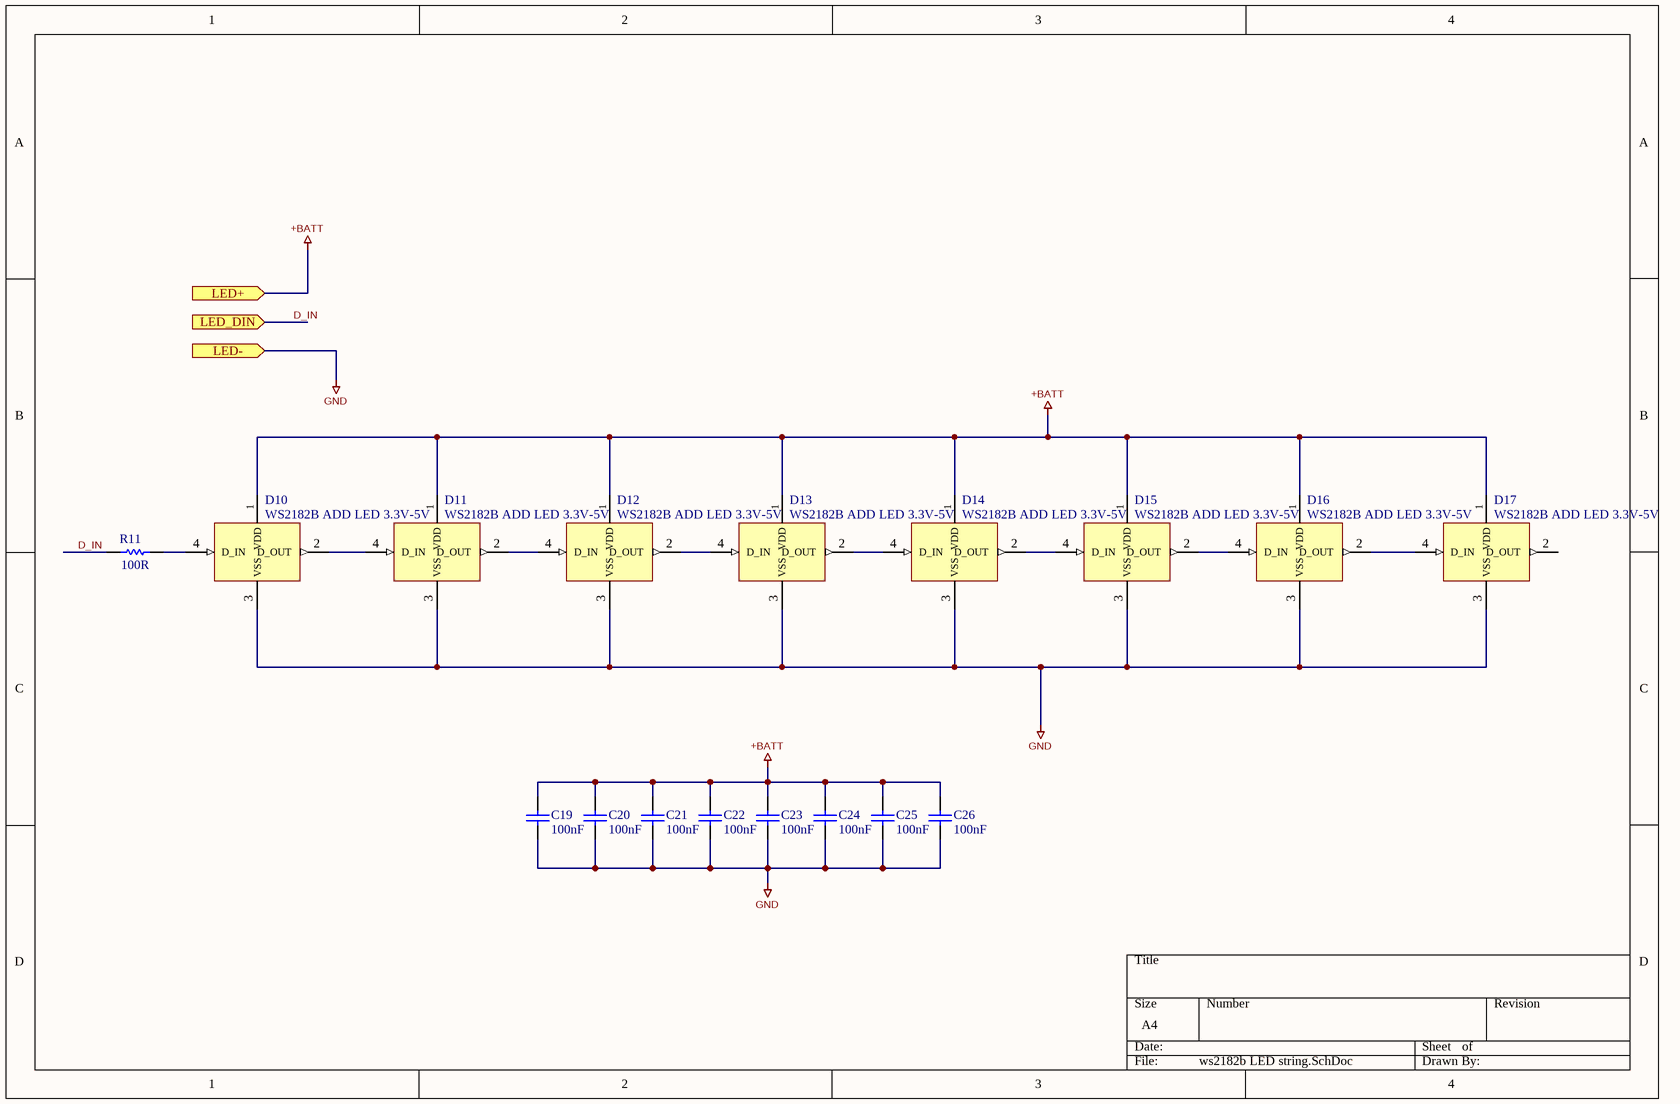
[diagram p5: ws2182b LED string.SchDoc]

### Parts
C19  100nF  [CAPC1608X90X20LL10]
C20  100nF  [CAPC1608X90X20LL10]
C21  100nF  [CAPC1608X90X20LL10]
C22  100nF  [CAPC1608X90X20LL10]
C23  100nF  [CAPC1608X90X20LL10]
C24  100nF  [CAPC1608X90X20LL10]
C25  100nF  [CAPC1608X90X20LL10]
C26  100nF  [CAPC1608X90X20LL10]
D10  WS2182B ADD LED 3.3V-5V  [WS2182B]
D11  WS2182B ADD LED 3.3V-5V  [WS2182B]
D12  WS2182B ADD LED 3.3V-5V  [WS2182B]
D13  WS2182B ADD LED 3.3V-5V  [WS2182B]
D14  WS2182B ADD LED 3.3V-5V  [WS2182B]
D15  WS2182B ADD LED 3.3V-5V  [WS2182B]
D16  WS2182B ADD LED 3.3V-5V  [WS2182B]
D17  WS2182B ADD LED 3.3V-5V  [WS2182B]
R11  100R  [RESC1608X55X25LL10T15]

### Ports
LED+ (in), LED- (in), LED_DIN (in)

### Nets
+BATT: C19.2 C20.2 C21.2 C22.2 C23.2 C24.2 C25.2 C26.2 D10.1(VDD) D11.1(VDD) D12.1(VDD) D13.1(VDD) D14.1(VDD) D15.1(VDD) D16.1(VDD) D17.1(VDD) ; port LED+
GND: C19.1 C20.1 C21.1 C22.1 C23.1 C24.1 C25.1 C26.1 D10.3(VSS) D11.3(VSS) D12.3(VSS) D13.3(VSS) D14.3(VSS) D15.3(VSS) D16.3(VSS) D17.3(VSS) ; port LED-
D_IN: R11.1 ; port LED_DIN
NetD10_2: D10.2(D_OUT) D11.4(D_IN)
NetD10_4: D10.4(D_IN) R11.2
NetD11_2: D11.2(D_OUT) D12.4(D_IN)
NetD12_2: D12.2(D_OUT) D13.4(D_IN)
NetD13_2: D13.2(D_OUT) D14.4(D_IN)
NetD14_2: D14.2(D_OUT) D15.4(D_IN)
NetD15_2: D15.2(D_OUT) D16.4(D_IN)
NetD16_2: D16.2(D_OUT) D17.4(D_IN)

Not connected (* = marked no-connect by the designer): D17 2(D_OUT)

### Library data of the parts
C19-C26 = CMP-2000-07546-1: Chip Capacitor, 0.1 uF, +/- 10%, 50 V, -55 to 125 degC, 0603 (1608 Metric), RoHS, Tape and Reel; Manufacturer: TDK; Voltage: 50V; Dielectric: X7R; Package Reference: 603; Radiation Hardening: No; Composition: Ceramic; Datasheet URL: https://product.tdk.com/info/en/catalog/datasheets/mlcc_automotive_general_en.pdf; Mounting Technology: SurfaceMount; Datasheet Version: 12/2014; Width: 0.8mm; Length: 1.6mm; Capacitance: 100nF; Tolerance: 10%; Case Code (Imperial): 0603; RoHSCompliant: True; Min Operating Temperature: -55degC; Package Description: 2-Pin Surface Mount Device, Body 1.6 x 0.8 mm; Packaging: TapeandReel; Package Quantity: 1; Voltage Rating: 50V; Mount: SurfaceMount; Lead Free: LeadFree; Depth: 0.8mm; Termination: SMD/SMT; Case Code (Metric): 1608; Thickness: 0.035inch; Height: 0.8mm; Weight: 7.1E-05oz; Voltage Rating (DC): 50V; REACH SVHC: NoSVHC; Manufacturer URL: http://www.tdk.com/; Case/Package: 0603; Max Operating Temperature: 125degC
D10-D17 = WS2182B
R11 = CMP-1659-00035-1: as R10 on sheet 3V3 voltage regulato; Fastening Type: Snap; Min Operating Temperature: -40 degC; Length: 3 mm; PackageReference: 0603; Contact Material: Brass; Max Operating Temperature: 90 degC; ComponentLink2URL: https://datasheet.ciiva.com/11808/0900766b80f96399-11808177.pdf; Packaging: Tape and Reel; DatasheetVersion: Rev. 4, 04/2009; Contact Plating: Gold; Radiation Hardening: No; Height: 1.25 mm; Resistance: 50 Ohm; RoHSCompliant: true; ComponentLink2Description: Datasheet; Package Quantity: 2500; ComponentLink1URL: http://www.yageo.com/; Width: 3.1 mm; Mount: Surface Mount; PackageDescription: 2-Pin Surface Mount Device, Body 1.6 x 0.8 mm; ComponentLink1Description: Manufacturer URL

## Sheet USB_HUB_4 Port.SchDoc
size A3
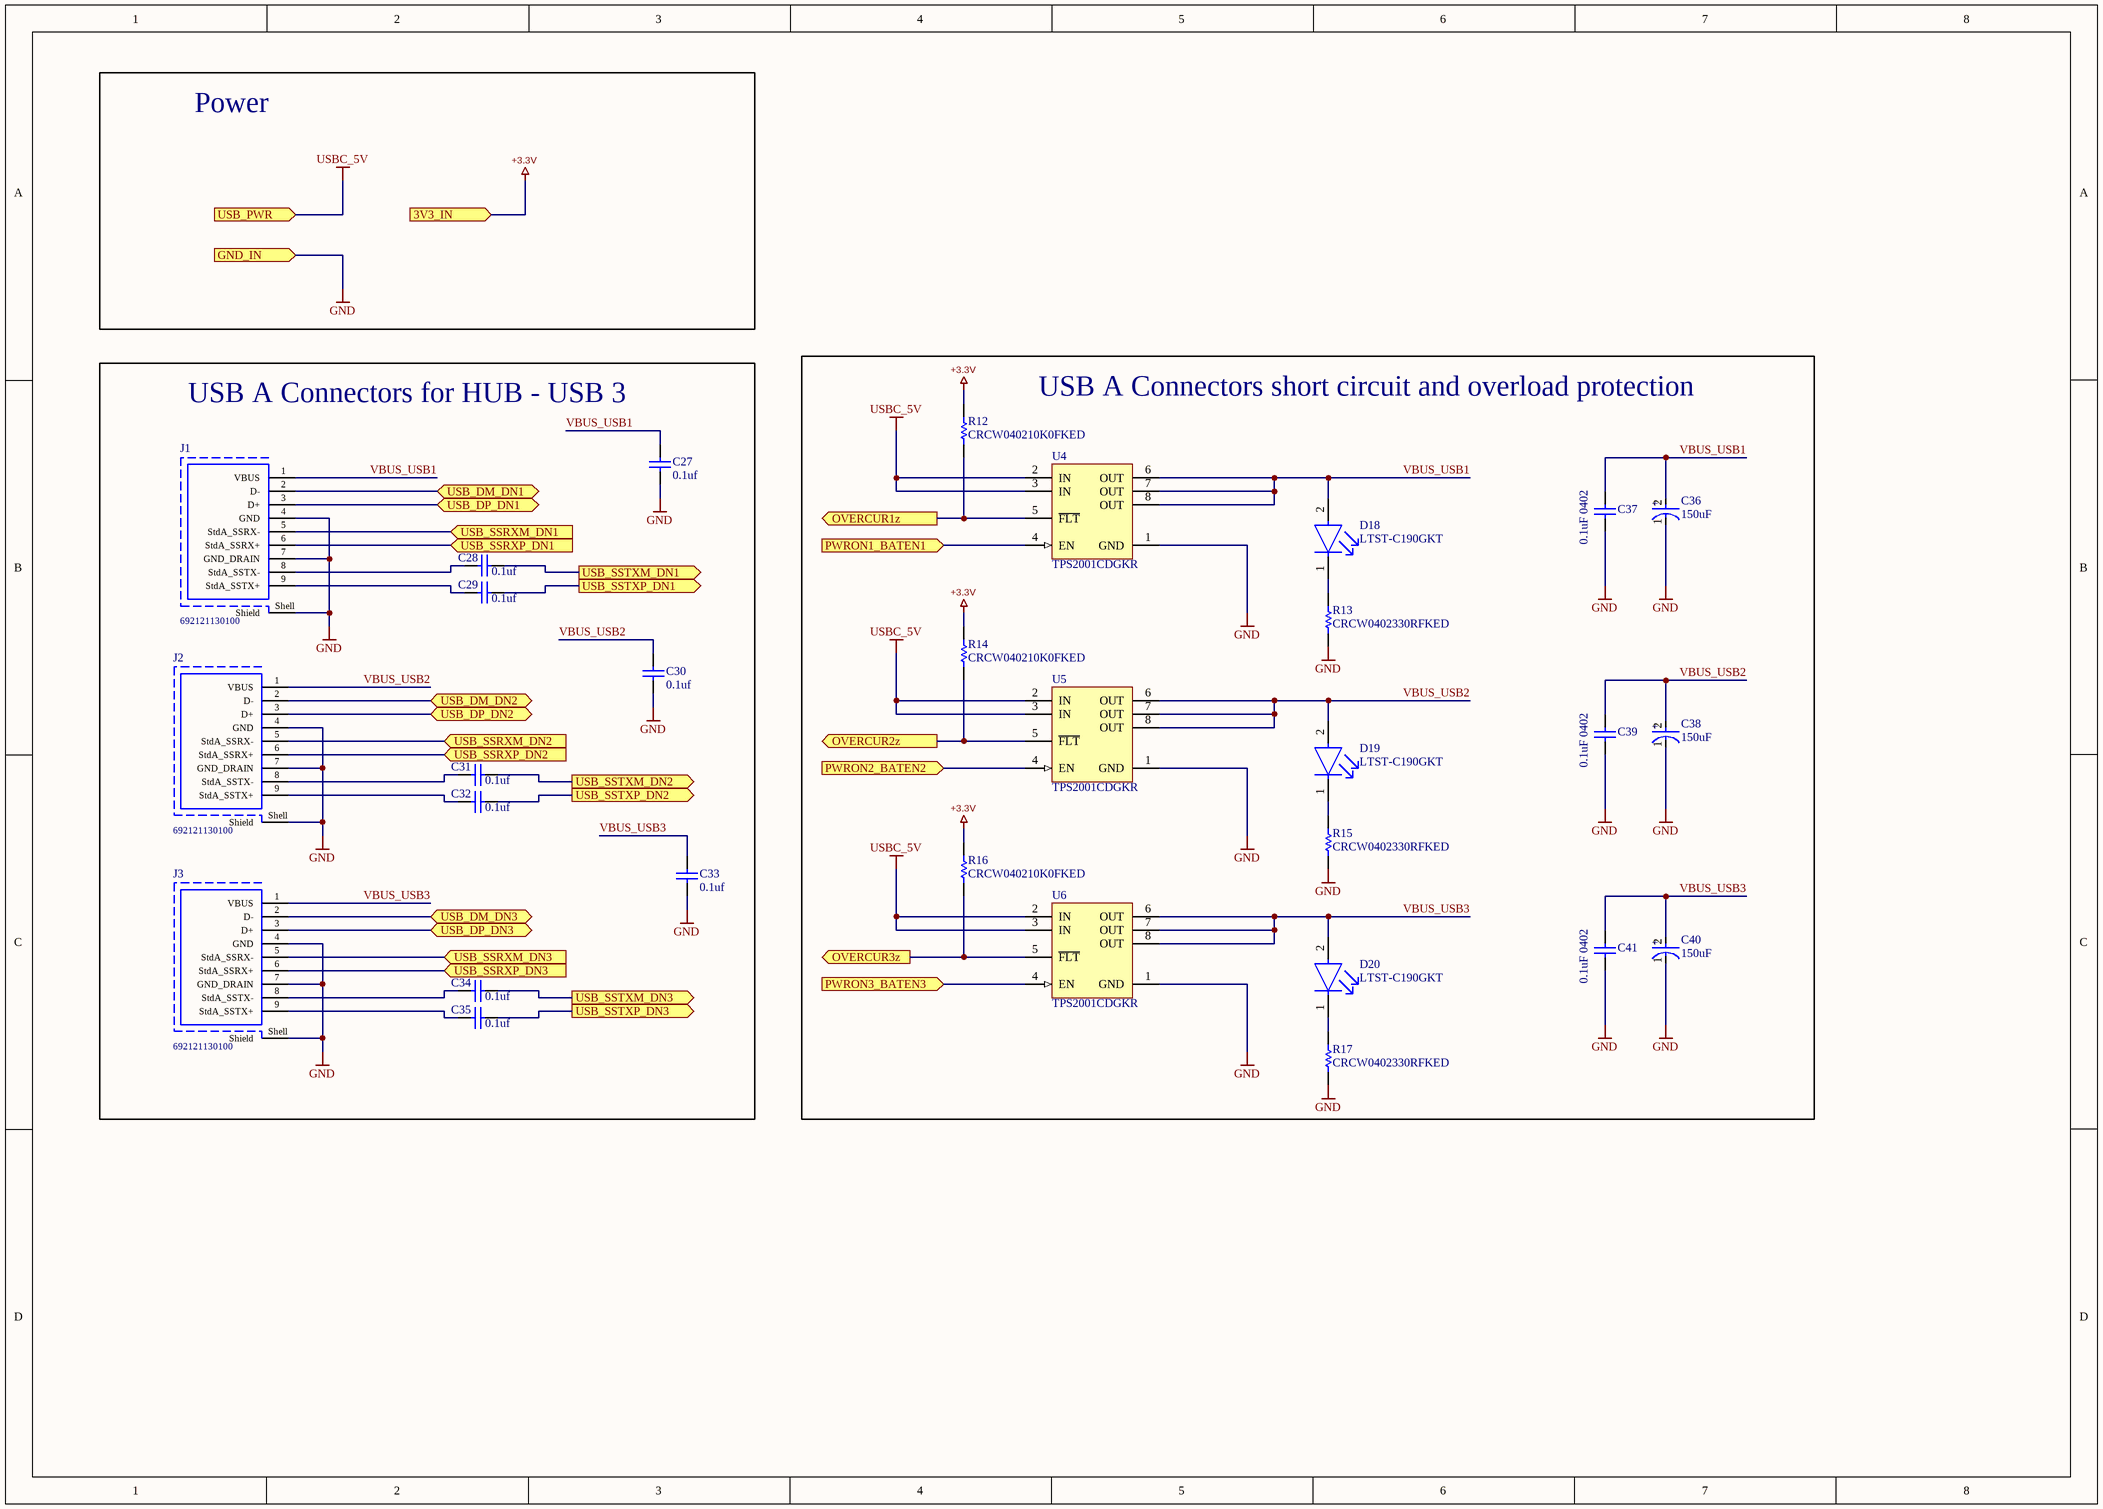
[diagram p6: USB_HUB_4 Port.SchDoc]

### Parts
C27  0.1uf  [CAPC1005X55X30ML05T10]
C28  0.1uf  [CAPC1005X55X30ML05T10]
C29  0.1uf  [CAPC1005X55X30ML05T10]
C30  0.1uf  [CAPC1005X55X30ML05T10]
C31  0.1uf  [CAPC1005X55X30ML05T10]
C32  0.1uf  [CAPC1005X55X30ML05T10]
C33  0.1uf  [CAPC1005X55X30ML05T10]
C34  0.1uf  [CAPC1005X55X30ML05T10]
C35  0.1uf  [CAPC1005X55X30ML05T10]
C36  150uF  [FP-SVPEB6-MFG]
C37  0.1uF 0402  [CAPC1005X55X30ML05T10]
C38  150uF  [FP-SVPEB6-MFG]
C39  0.1uF 0402  [CAPC1005X55X30ML05T10]
C40  150uF  [FP-SVPEB6-MFG]
C41  0.1uF 0402  [CAPC1005X55X30ML05T10]
D18  LTST-C190GKT  [FP-LTST-C190GKT-MFG]
D19  LTST-C190GKT  [FP-LTST-C190GKT-MFG]
D20  LTST-C190GKT  [FP-LTST-C190GKT-MFG]
J1  692121130100  [692121130100]
J2  692121130100  [692121130100]
J3  692121130100  [692121130100]
R12  CRCW040210K0FKED  [RESC1005X40X25NL05T05]
R13  CRCW0402330RFKED  [RESC1005X40X25NL05T05]
R14  CRCW040210K0FKED  [RESC1005X40X25NL05T05]
R15  CRCW0402330RFKED  [RESC1005X40X25NL05T05]
R16  CRCW040210K0FKED  [RESC1005X40X25NL05T05]
R17  CRCW0402330RFKED  [RESC1005X40X25NL05T05]
U4  TPS2001CDGKR  [DGK0008A_L]
U5  TPS2001CDGKR  [DGK0008A_L]
U6  TPS2001CDGKR  [DGK0008A_L]

### Blocks framed on the sheet
USB A Connectors for HUB - USB 3: C27-C35 J1-J3
USB A Connectors short circuit and overload protection: C36-C41 D18-D20 R12-R17 U4-U6

### Ports
3V3_IN (in), GND_IN (in), OVERCUR1z (out), OVERCUR2z (out), OVERCUR3z (out), PWRON1_BATEN1 (in), PWRON2_BATEN2 (in), PWRON3_BATEN3 (in), USB_DM_DN1 (bidir), USB_DM_DN2 (bidir), USB_DM_DN3 (bidir), USB_DP_DN1 (bidir), USB_DP_DN2 (bidir), USB_DP_DN3 (bidir), USB_PWR (in), USB_SSRXM_DN1 (in), USB_SSRXM_DN2 (in), USB_SSRXM_DN3 (in), USB_SSRXP_DN1 (in), USB_SSRXP_DN2 (in), USB_SSRXP_DN3 (in), USB_SSTXM_DN1 (out), USB_SSTXM_DN2 (out), USB_SSTXM_DN3 (out), USB_SSTXP_DN1 (out), USB_SSTXP_DN2 (out), USB_SSTXP_DN3 (out)

### Nets
+3.3V: R12.2 R14.2 R16.2 ; port 3V3_IN
GND: C27.1 C30.1 C33.1 C36.1(C) C37.1 C38.1(C) C39.1 C40.1(C) C41.1 J1.4(GND) J1.7(GND_DRAIN) J1.Shell(Shield) J2.4(GND) J2.7(GND_DRAIN) J2.Shell(Shield) J3.4(GND) J3.7(GND_DRAIN) J3.Shell(Shield) R13.1 R15.1 R17.1 U4.1(GND) U5.1(GND) U6.1(GND) ; port GND_IN
USBC_5V: U4.2(IN) U4.3(IN) U5.2(IN) U5.3(IN) U6.2(IN) U6.3(IN) ; port USB_PWR  [project net +BATT]
BATEN1: U4.4(EN) ; port PWRON1_BATEN1
BATEN2: U5.4(EN) ; port PWRON2_BATEN2
BATEN3: U6.4(EN) ; port PWRON3_BATEN3
DM_DN1: J1.2(D-) ; port USB_DM_DN1
DM_DN2: J2.2(D-) ; port USB_DM_DN2
DM_DN3: J3.2(D-) ; port USB_DM_DN3
DP_DN1: J1.3(D+) ; port USB_DP_DN1
DP_DN2: J2.3(D+) ; port USB_DP_DN2
DP_DN3: J3.3(D+) ; port USB_DP_DN3
OVCUR1: R12.1 U4.5(~{FLT}) ; port OVERCUR1z
OVCUR2: R14.1 U5.5(~{FLT}) ; port OVERCUR2z
OVCUR3: R16.1 U6.5(~{FLT}) ; port OVERCUR3z
RXM_DN1: J1.5(StdA_SSRX-) ; port USB_SSRXM_DN1
RXM_DN2: J2.5(StdA_SSRX-) ; port USB_SSRXM_DN2
RXM_DN3: J3.5(StdA_SSRX-) ; port USB_SSRXM_DN3
RXP_DN1: J1.6(StdA_SSRX+) ; port USB_SSRXP_DN1
RXP_DN2: J2.6(StdA_SSRX+) ; port USB_SSRXP_DN2
RXP_DN3: J3.6(StdA_SSRX+) ; port USB_SSRXP_DN3
TXM_DN1: C28.2 ; port USB_SSTXM_DN1
TXM_DN2: C31.2 ; port USB_SSTXM_DN2
TXM_DN3: C34.2 ; port USB_SSTXM_DN3
TXP_DN1: C29.2 ; port USB_SSTXP_DN1
TXP_DN2: C32.2 ; port USB_SSTXP_DN2
TXP_DN3: C35.2 ; port USB_SSTXP_DN3
VBUS_USB1: C27.2 C36.2(A) C37.2 D18.2(A) J1.1(VBUS) U4.6(OUT) U4.7(OUT) U4.8(OUT)
VBUS_USB2: C30.2 C38.2(A) C39.2 D19.2(A) J2.1(VBUS) U5.6(OUT) U5.7(OUT) U5.8(OUT)
VBUS_USB3: C33.2 C40.2(A) C41.2 D20.2(A) J3.1(VBUS) U6.6(OUT) U6.7(OUT) U6.8(OUT)
NetC28_1: C28.1 J1.8(StdA_SSTX-)
NetC29_1: C29.1 J1.9(StdA_SSTX+)
NetC31_1: C31.1 J2.8(StdA_SSTX-)
NetC32_1: C32.1 J2.9(StdA_SSTX+)
NetC34_1: C34.1 J3.8(StdA_SSTX-)
NetC35_1: C35.1 J3.9(StdA_SSTX+)
NetD18_1: D18.1(C) R13.2
NetD19_1: D19.1(C) R15.2
NetD20_1: D20.1(C) R17.2

### Notes on the sheet
- Power
- Title
- Size:
- Date:
- A3
- Number:
- Time:
- Revision:
- Sheet
- of
- File:
- (in symbol CMP-05428-000017-1) +

### Library data of the parts
C27-C35 C37 C39 C41 = CMP-2008-03080-1: as C6 on sheet STM32
C36 C38 C40 = CMP-05428-000017-1: CAP ALUM POLY 150UF 20% 6.3V SMD; Ripple Current: 3.52A; Life (Hours): 2000Hour; Leakage Current: 500uA; Dissipation Factor: 12%; Polarity: Polar; ESR (Equivalent Series Resistance): 12mR; Min Operating Temperature: -55°C; Height: 5.9mm; Lead Free: Lead Free; Case/Package: Radial; Length: 5.9mm; Tolerance: 20%; Packaging: Tape and Reel; Capacitance: 150uF; Max Operating Temperature: 105°C; Package Quantity: 1500; Ripple Current (AC): 3.52A; Voltage Rating: 6.3V; Height - Seated (Max): 0.236inch; REACH SVHC: No SVHC; Number of Pins: 6; Voltage Rating (DC): 6.3V; Mount: Surface Mount; Voltage: 6.3V; Termination: SMD/SMT; Diameter: 5mm
D18-D20 = CMP-22017-000005-1: LED GREEN CLEAR CHIP SMD; Reverse Voltage: 5V; Power Dissipation: 100mW; Forward Voltage: 2.1V; Test Current: 10mA; Number of LEDs: 1; Viewing Angle: 130°; Forward Current: 30mA; Voltage: 2V; Wavelength: 565nm; Dominant Wavelength: 569nm; Luminous Intensity: 6mcd; Lens Color: Colorless; Packaging: Tape and Reel; Lens Transparency: Clear; Min Operating Temperature: -55°C; Case Code (Metric): 1608; Lens Style: Clear; Case/Package: 0603; Mount: Surface Mount; Package Quantity: 1; Height: 0.8mm; Illumination Color: Green; Radiation Hardening: No; Depth: 0.8mm; Number of Pins: 2; Max Operating Temperature: 85°C; Color: Green; Number of Elements: 1; Power Rating: 100mW; Case Code (Imperial): 0603; Width: 0.8mm; Length: 1.6mm; Lead Free: Lead Free
J1-J3 = CMP-1502-03218-1: USB 3.0 Type A Receptacle WR-COM, Reverse Horizontal, SMT / THT, with Clips, with 0.14 mm Offset; Manufacturer: Wurth Elektronik; Contact Resistance: 50mOhm; Rated Current: 0.25A; Working Voltage: 30VAC; Operating Temperature: -20to85degC; Packaging: TapeandReel; Datasheet URL: https://katalog.we-online.de/em/datasheet/692121130100.pdf; Orientation: ReverseHorizontal; Gender: Receptacle; Package Reference: 692121130100; Connector Type: USB3.0TypeA; Publisher: WurthElektronik; Manufacturer URL: http://www.we-online.de; Part Number: 692121130100; Mounting Technology: SMT/THT
R12 R14 R16 = CMP-2002-08135-1: Manufacturer: Vishay Dale; Part Number: CRCW040210K0FKED
R13 R15 R17 = CMP-2002-08523-1: Manufacturer: Vishay Dale; Part Number: CRCW0402330RFKED
U4-U6 = CMP-0337-00297-2: Single Channel, Current-Limited USB Power Distribution Switch, 2.9 A Current Limit, -40 to 85 degC, 8-pin VSSOP (DGK), Green (RoHS & no Sb/Br); Manufacturer: Texas Instruments; Current Limit(A): 2.9; rDS(on) per FET(Typ)(mOhms): 70; Discharge Function: TRUE; Rating: Catalog; Number of Switches: 1; Continuous Current(Max)(A): 2; Vin(Max)(V): 5.5; Vin(Min)(V): 4.5; Enable: Active High; Mounting Technology: Surface Mount; Eco-Plan: Green (RoHS & no Sb/Br); PartNumber: TPS2001CDGKR; ComponentLink1URL: http://www.ti.com/general/docs/lit/getliterature.tsp?genericPartNumber=TPS2001C&fileType=pdf; PackageDescription: 8-Pin Thin Small Outline Package 3 x 3 mm Body ,0.65 mm Pitch; ComponentLink1Description: Datasheet; UL Listed: TRUE; PackageVersion: revE, May-2006; DatasheetVersion: SLVSAU6E; PackageReference: DGK0008A; Code_JEDEC: MO-187-AA

## Sheet TUSB8041-Q1-4port Hub.SchDoc
size A3
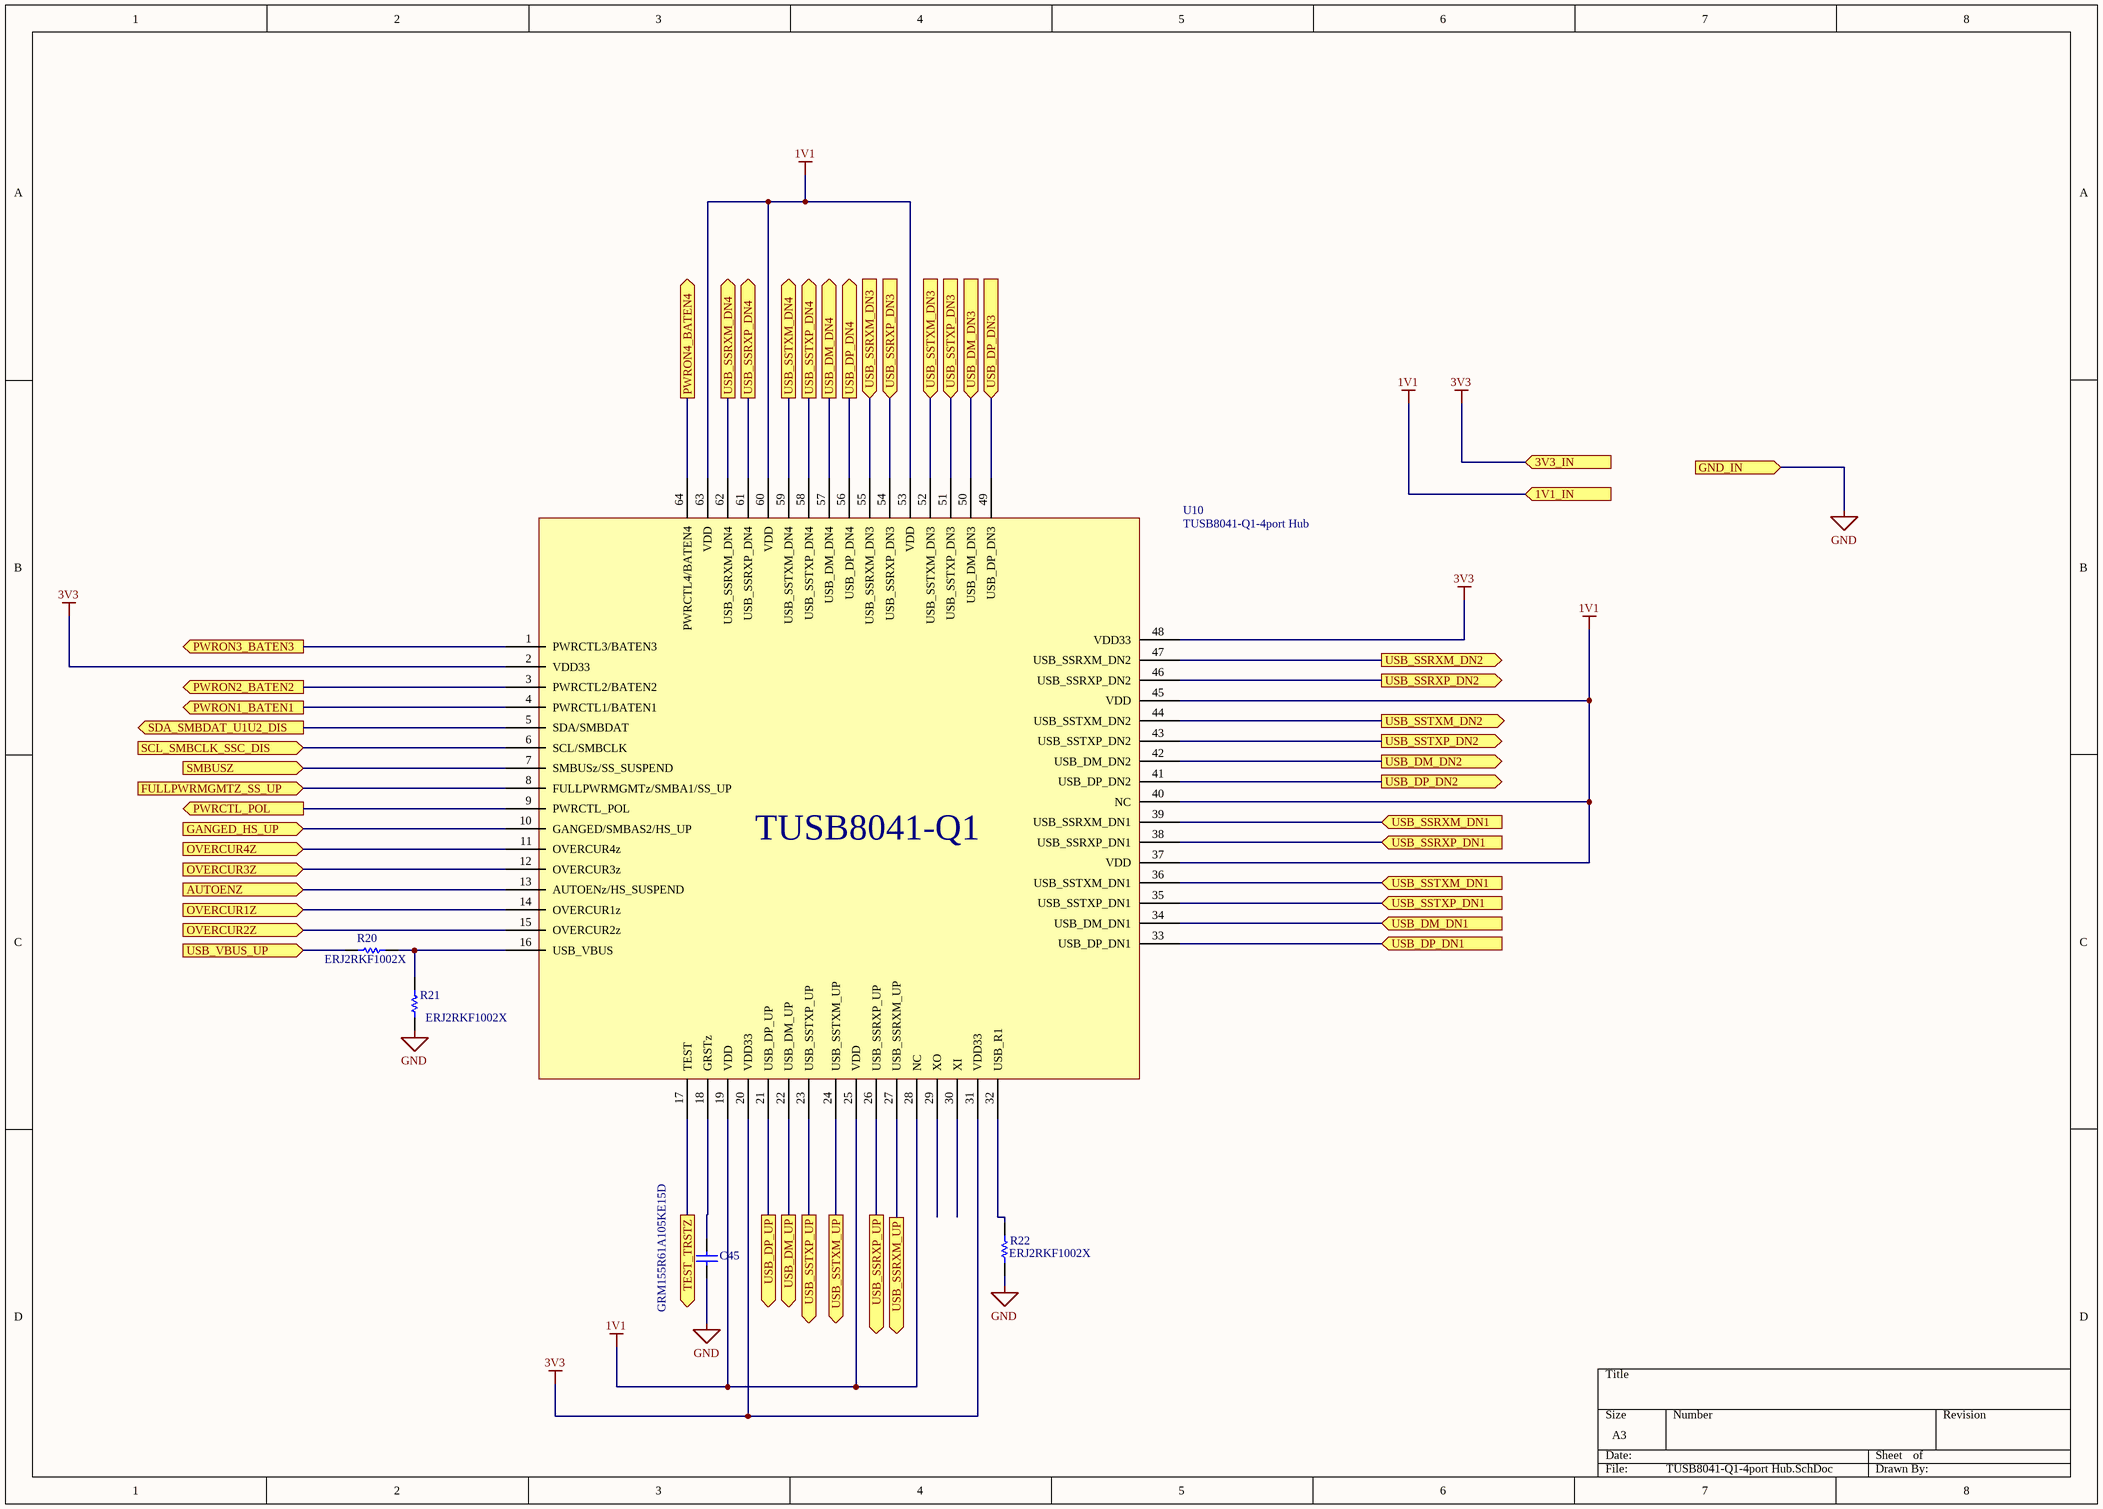
[diagram p7: TUSB8041-Q1-4port Hub.SchDoc]

### Parts
C45  GRM155R61A105KE15D  [CAPC1005X55X25NL05T10]
R20  ERJ2RKF1002X  [RESC1005X40X25LL05T05]
R21  ERJ2RKF1002X  [RESC1005X40X25LL05T05]
R22  ERJ2RKF1002X  [RESC1005X40X25LL05T05]
U10  TUSB8041-Q1-4port Hub  [TSQFP50P1200X1200X120-64N]

### Ports
1V1_IN (in), 3V3_IN (in), AUTOENZ (in), FULLPWRMGMTZ_SS_UP (in), GANGED_HS_UP (in), GND_IN (in), OVERCUR1Z (in), OVERCUR2Z (in), OVERCUR3Z (in), OVERCUR4Z (in), PWRCTL_POL (out), PWRON1_BATEN1 (out), PWRON2_BATEN2 (out), PWRON3_BATEN3 (out), PWRON4_BATEN4 (out), SCL_SMBCLK_SSC_DIS (in), SDA_SMBDAT_U1U2_DIS (out), SMBUSZ (in), TEST_TRSTZ (out), USB_DM_DN1 (in), USB_DM_DN2 (out), USB_DM_DN3 (in), USB_DM_DN4 (out), USB_DM_UP (out), USB_DP_DN1 (in), USB_DP_DN2 (out), USB_DP_DN3 (in), USB_DP_DN4 (out), USB_DP_UP (out), USB_SSRXM_DN1 (in), USB_SSRXM_DN2 (out), USB_SSRXM_DN3 (in), USB_SSRXM_DN4 (out), USB_SSRXM_UP (out), USB_SSRXP_DN1 (in), USB_SSRXP_DN2 (out), USB_SSRXP_DN3 (in), USB_SSRXP_DN4 (out), USB_SSRXP_UP (out), USB_SSTXM_DN1 (in), USB_SSTXM_DN2 (out), USB_SSTXM_DN3 (in), USB_SSTXM_DN4 (out), USB_SSTXM_UP (out), USB_SSTXP_DN1 (in), USB_SSTXP_DN2 (out), USB_SSTXP_DN3 (in), USB_SSTXP_DN4 (out), USB_SSTXP_UP (out), USB_VBUS_UP (in)

### Nets
1V1: U10.19(VDD) U10.25(VDD) U10.28(NC) U10.37(VDD) U10.40(NC) U10.45(VDD) U10.53(VDD) U10.60(VDD) U10.63(VDD) ; port 1V1_IN  [project net +1V1]
3V3: U10.2(VDD33) U10.20(VDD33) U10.31(VDD33) U10.48(VDD33) ; port 3V3_IN  [project net +3.3V]
+BATT: R20.2 ; port USB_VBUS_UP
GND: C45.1 R21.1 R22.1 ; port GND_IN
AUTOENZ: U10.13(AUTOENz/HS_SUSPEND) ; port AUTOENZ
BATEN1: U10.4(PWRCTL1/BATEN1) ; port PWRON1_BATEN1
BATEN2: U10.3(PWRCTL2/BATEN2) ; port PWRON2_BATEN2
BATEN3: U10.1(PWRCTL3/BATEN3) ; port PWRON3_BATEN3
DM_DN1: U10.34(USB_DM_DN1) ; port USB_DM_DN1
DM_DN2: U10.43(USB_SSTXP_DN2) ; port USB_SSTXP_DN2
DM_DN3: U10.49(USB_DP_DN3) ; port USB_DP_DN3
DP_DN1: U10.33(USB_DP_DN1) ; port USB_DP_DN1
DP_DN2: U10.41(USB_DP_DN2) ; port USB_DP_DN2
DP_DN3: U10.54(USB_SSRXP_DN3) ; port USB_SSRXP_DN3
FULLPWRMGMTZ_SS_UP: U10.8(FULLPWRMGMTz/SMBA1/SS_UP) ; port FULLPWRMGMTZ_SS_UP
GANGED_HS_UP: U10.10(GANGED/SMBAS2/HS_UP) ; port GANGED_HS_UP
OVCUR1: U10.14(OVERCUR1z) ; port OVERCUR1Z
OVCUR2: U10.15(OVERCUR2z) ; port OVERCUR2Z
OVCUR3: U10.12(OVERCUR3z) ; port OVERCUR3Z
OVERCUR4Z: U10.11(OVERCUR4z) ; port OVERCUR4Z
PWRCTL_POL: U10.9(PWRCTL_POL) ; port PWRCTL_POL
PWRON4_BATEN4: U10.64(PWRCTL4/BATEN4) ; port PWRON4_BATEN4
RXM_DN1: U10.39(USB_SSRXM_DN1) ; port USB_SSRXM_DN1
RXM_DN2: U10.46(USB_SSRXP_DN2) ; port USB_SSRXP_DN2
RXM_DN3: U10.50(USB_DM_DN3) ; port USB_DM_DN3
RXP_DN1: U10.38(USB_SSRXP_DN1) ; port USB_SSRXP_DN1
RXP_DN2: U10.47(USB_SSRXM_DN2) ; port USB_SSRXM_DN2
RXP_DN3: U10.52(USB_SSTXM_DN3) ; port USB_SSTXM_DN3
SCL_SMBCLK_SSC_DIS: U10.6(SCL/SMBCLK) ; port SCL_SMBCLK_SSC_DIS
SDA_SMBDAT_U1U2_DIS: U10.5(SDA/SMBDAT) ; port SDA_SMBDAT_U1U2_DIS
SMBUSZ: U10.7(SMBUSz/SS_SUSPEND) ; port SMBUSZ
TEST_TRSTZ: U10.17(TEST) ; port TEST_TRSTZ
TXM_DN1: U10.36(USB_SSTXM_DN1) ; port USB_SSTXM_DN1
TXM_DN2: U10.42(USB_DM_DN2) ; port USB_DM_DN2
TXM_DN3: U10.51(USB_SSTXP_DN3) ; port USB_SSTXP_DN3
TXP_DN1: U10.35(USB_SSTXP_DN1) ; port USB_SSTXP_DN1
TXP_DN2: U10.44(USB_SSTXM_DN2) ; port USB_SSTXM_DN2
TXP_DN3: U10.55(USB_SSRXM_DN3) ; port USB_SSRXM_DN3
USB_DM_DN4: U10.57(USB_DM_DN4) ; port USB_DM_DN4
USB_DM_UP: U10.22(USB_DM_UP) ; port USB_DM_UP
USB_DP_DN4: U10.56(USB_DP_DN4) ; port USB_DP_DN4
USB_DP_UP: U10.21(USB_DP_UP) ; port USB_DP_UP
USB_SSRXM_DN4: U10.62(USB_SSRXM_DN4) ; port USB_SSRXM_DN4
USB_SSRXM_UP: U10.27(USB_SSRXM_UP) ; port USB_SSRXM_UP
USB_SSRXP_DN4: U10.61(USB_SSRXP_DN4) ; port USB_SSRXP_DN4
USB_SSRXP_UP: U10.26(USB_SSRXP_UP) ; port USB_SSRXP_UP
USB_SSTXM_DN4: U10.59(USB_SSTXM_DN4) ; port USB_SSTXM_DN4
USB_SSTXM_UP: U10.24(USB_SSTXM_UP) ; port USB_SSTXM_UP
USB_SSTXP_DN4: U10.58(USB_SSTXP_DN4) ; port USB_SSTXP_DN4
USB_SSTXP_UP: U10.23(USB_SSTXP_UP) ; port USB_SSTXP_UP
NetC45_2: C45.2 U10.18(GRSTz)
NetR20_1: R20.1 R21.2 U10.16(USB_VBUS)
NetR22_2: R22.2 U10.32(USB_R1)

Not connected (* = marked no-connect by the designer): U10 29(XO) 30(XI)

### Notes on the sheet
- (in symbol TUSB8041-Q1-4port Hub) TUSB8041-Q1

### Library data of the parts
C45 = CMP-2008-04556-1: Manufacturer: Murata; Part Number: GRM155R61A105KE15D
R20-R22 = CMP-2000-07588-1: Chip Resistor, 10 KOhm, +/- 1%, 0.1 W, -55 to 155 degC, 0402 (1005 Metric), RoHS, Tape and Reel; Manufacturer: Panasonic; Power Rating: 100mW; Voltage Rating: 50V; Resistance: 10KOhm; Case\/Package: 0402; Temperature Coefficient: 100ppm\/degreesC; RoHSCompliant: True; Lead Free: LeadFree; Package Quantity: 1; Contact Plating: Tin; Length: 1mm; Radiation Hardening: No; REACH SVHC: NoSVHC; Max Operating Temperature: 155degC; Depth: 0.5mm; Case Code (Imperial): 0402; Military Standard: Not; Package Description: 2-Pin Surface Mount Device, Body 1 x 0.5 mm; Termination: SMD/SMT; Case Code (Metric): 1005; Height: 0.35mm; Packaging: TapeandReel; Voltage Rating (DC): 50V; Package Reference: 402; Number of Pins: 2; Tolerance: 1%; Mounting Technology: SurfaceMount; Width: 0.02inch; Mount: SurfaceMount; Datasheet URL: https://industrial.panasonic.com/cdbs/www-data/pdf/RDA0000/AOA0000C304.pdf; Composition: ThickFilm; Datasheet Version: 02/2017; Manufacturer URL: http://www.panasonic.com/; Max Power Dissipation: 100mW; Number of Terminations: 2; Min Operating Temperature: -55degC

## Nets that join several sheets
+1V1: 3V3 voltage regulato (6 pins), TUSB8041-Q1-4port Hub (9 pins)
+3.3V: Keypadmacro (P1.2), Sound Intimator (R1.2 U1.6), STM32 (13 pins), 3V3 voltage regulato (11 pins), USB_HUB_4 Port (R12.2 R14.2 R16.2), TUSB8041-Q1-4port Hub (U10.2 U10.20 U10.31 U10.48)
+BATT: Keypadmacro (5 pins), 3V3 voltage regulato (C18.2 U3.1 U3.3), ws2182b LED string (16 pins), USB_HUB_4 Port (6 pins), TUSB8041-Q1-4port Hub (R20.2)
GND: Keypadmacro (9 pins), Sound Intimator (6 pins), STM32 (15 pins), Cherry MX (9 pins), 3V3 voltage regulato (11 pins), ws2182b LED string (16 pins), USB_HUB_4 Port (24 pins), TUSB8041-Q1-4port Hub (C45.1 R21.1 R22.1)
BATEN1: USB_HUB_4 Port (U4.4), TUSB8041-Q1-4port Hub (U10.4)
BATEN2: USB_HUB_4 Port (U5.4), TUSB8041-Q1-4port Hub (U10.3)
BATEN3: USB_HUB_4 Port (U6.4), TUSB8041-Q1-4port Hub (U10.1)
CH_COL1: STM32 (U2.40), Cherry MX (D3.1 D6.1 D9.1)
CH_COL2: STM32 (U2.41), Cherry MX (D2.1 D5.1 D8.1)
CH_COL3: STM32 (U2.42), Cherry MX (D1.1 D4.1 D7.1)
CH_ROW1: STM32 (U2.18), Cherry MX (SW1.1 SW2.1 SW3.1)
CH_ROW2: STM32 (U2.19), Cherry MX (SW4.1 SW5.1 SW6.1)
CH_ROW3: STM32 (U2.20), Cherry MX (SW7.1 SW8.1 SW9.1)
D_IN: STM32 (U2.11), ws2182b LED string (R11.1)
DIN_EXT: Keypadmacro (P2.2), STM32 (U2.12)
DM_DN1: USB_HUB_4 Port (J1.2), TUSB8041-Q1-4port Hub (U10.34)
DM_DN2: USB_HUB_4 Port (J2.2), TUSB8041-Q1-4port Hub (U10.43)
DM_DN3: USB_HUB_4 Port (J3.2), TUSB8041-Q1-4port Hub (U10.49)
DP_DN1: USB_HUB_4 Port (J1.3), TUSB8041-Q1-4port Hub (U10.33)
DP_DN2: USB_HUB_4 Port (J2.3), TUSB8041-Q1-4port Hub (U10.41)
DP_DN3: USB_HUB_4 Port (J3.3), TUSB8041-Q1-4port Hub (U10.54)
MIC_OUT_TO_CONTROLLER: Sound Intimator (C2.2), STM32 (U2.10)
OVCUR1: USB_HUB_4 Port (R12.1 U4.5), TUSB8041-Q1-4port Hub (U10.14)
OVCUR2: USB_HUB_4 Port (R14.1 U5.5), TUSB8041-Q1-4port Hub (U10.15)
OVCUR3: USB_HUB_4 Port (R16.1 U6.5), TUSB8041-Q1-4port Hub (U10.12)
RXM_DN1: USB_HUB_4 Port (J1.5), TUSB8041-Q1-4port Hub (U10.39)
RXM_DN2: USB_HUB_4 Port (J2.5), TUSB8041-Q1-4port Hub (U10.46)
RXM_DN3: USB_HUB_4 Port (J3.5), TUSB8041-Q1-4port Hub (U10.50)
RXP_DN1: USB_HUB_4 Port (J1.6), TUSB8041-Q1-4port Hub (U10.38)
RXP_DN2: USB_HUB_4 Port (J2.6), TUSB8041-Q1-4port Hub (U10.47)
RXP_DN3: USB_HUB_4 Port (J3.6), TUSB8041-Q1-4port Hub (U10.52)
TXM_DN1: USB_HUB_4 Port (C28.2), TUSB8041-Q1-4port Hub (U10.36)
TXM_DN2: USB_HUB_4 Port (C31.2), TUSB8041-Q1-4port Hub (U10.42)
TXM_DN3: USB_HUB_4 Port (C34.2), TUSB8041-Q1-4port Hub (U10.51)
TXP_DN1: USB_HUB_4 Port (C29.2), TUSB8041-Q1-4port Hub (U10.35)
TXP_DN2: USB_HUB_4 Port (C32.2), TUSB8041-Q1-4port Hub (U10.44)
TXP_DN3: USB_HUB_4 Port (C35.2), TUSB8041-Q1-4port Hub (U10.55)
USB_DM_UP: Keypadmacro (J4.A7 J4.B7), TUSB8041-Q1-4port Hub (U10.22)
USB_DP_UP: Keypadmacro (J4.A6 J4.B6), TUSB8041-Q1-4port Hub (U10.21)
USB_SSRXM_UP: Keypadmacro (J4.A10 J4.B3), TUSB8041-Q1-4port Hub (U10.27)
USB_SSRXP_UP: Keypadmacro (J4.A11 J4.B2), TUSB8041-Q1-4port Hub (U10.26)
USB_SSTXM_UP: Keypadmacro (J4.A3 J4.B10), TUSB8041-Q1-4port Hub (U10.24)
USB_SSTXP_UP: Keypadmacro (J4.A2 J4.B11), TUSB8041-Q1-4port Hub (U10.23)